# Altium project HYDRA_V3_POWER.PrjPcb (part 1 of 2)
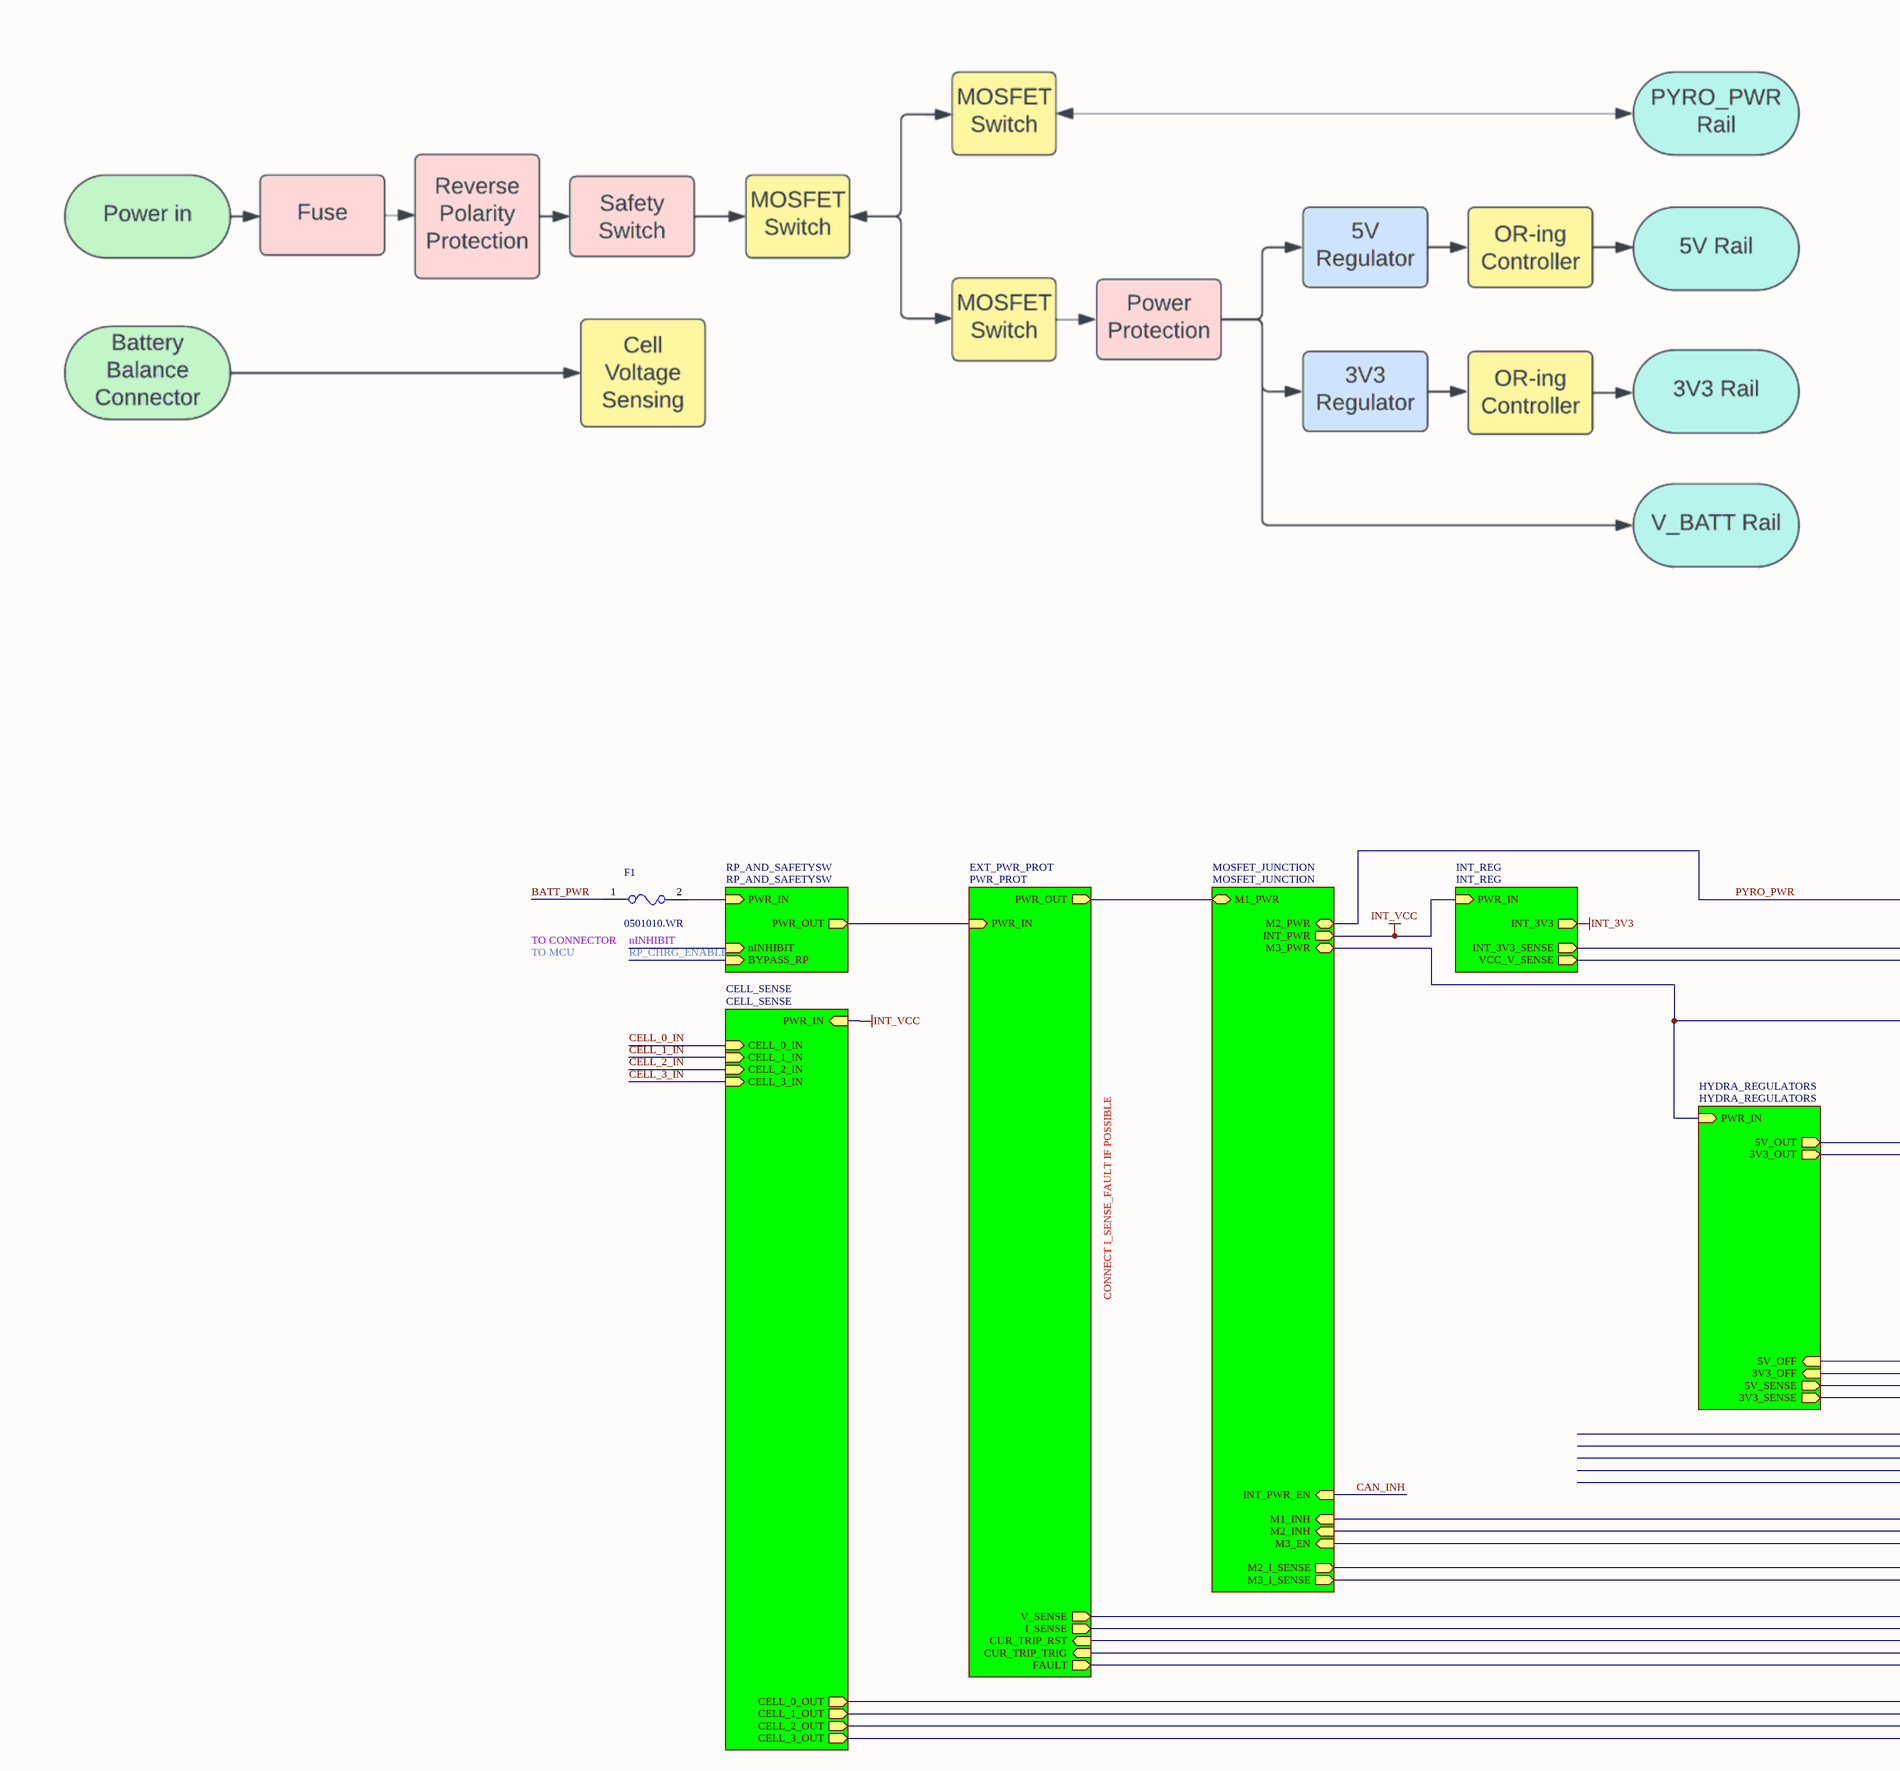
[diagram p0: HYDRA_V3_POWER.SchDoc, top left]
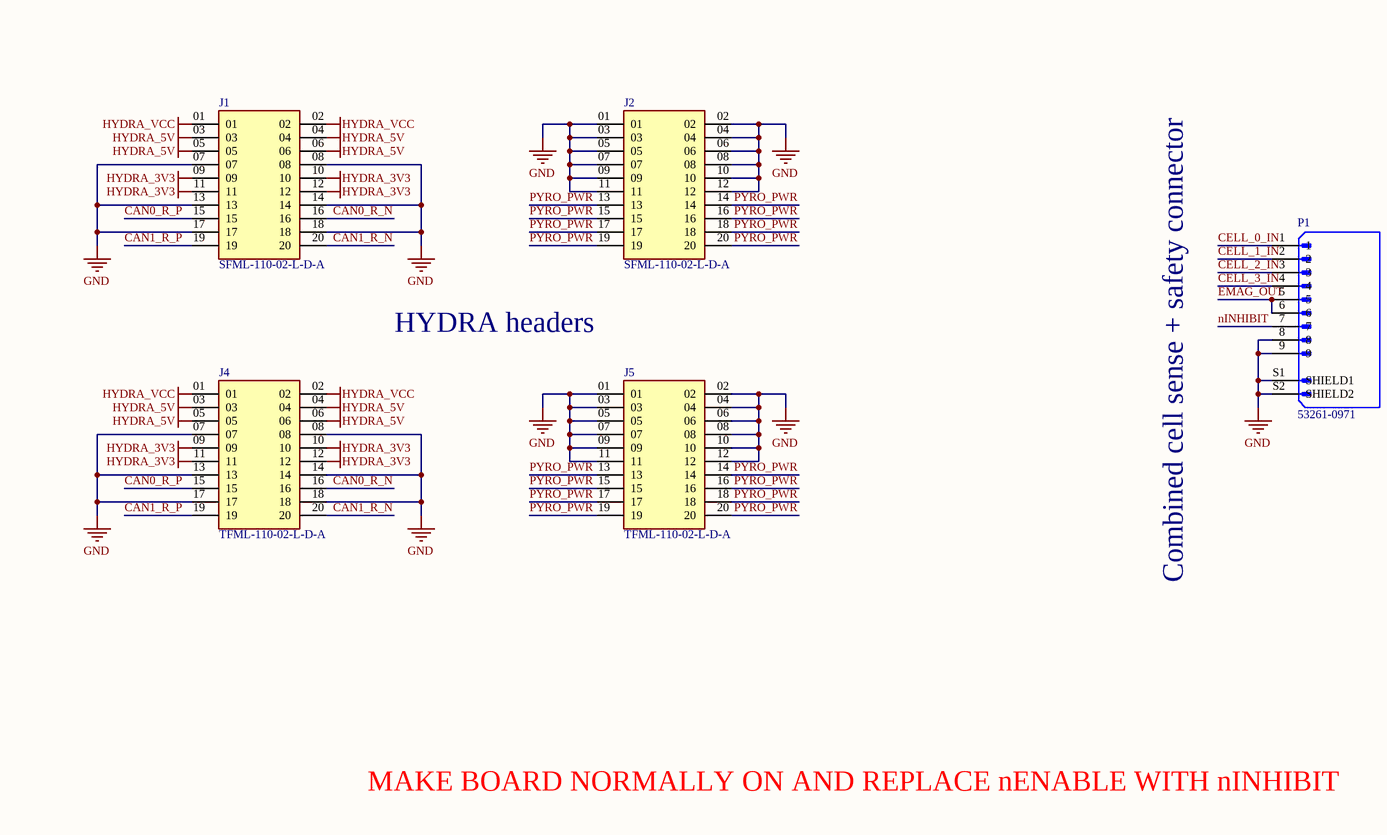
[diagram p1: HYDRA_V3_POWER.SchDoc, bottom left]
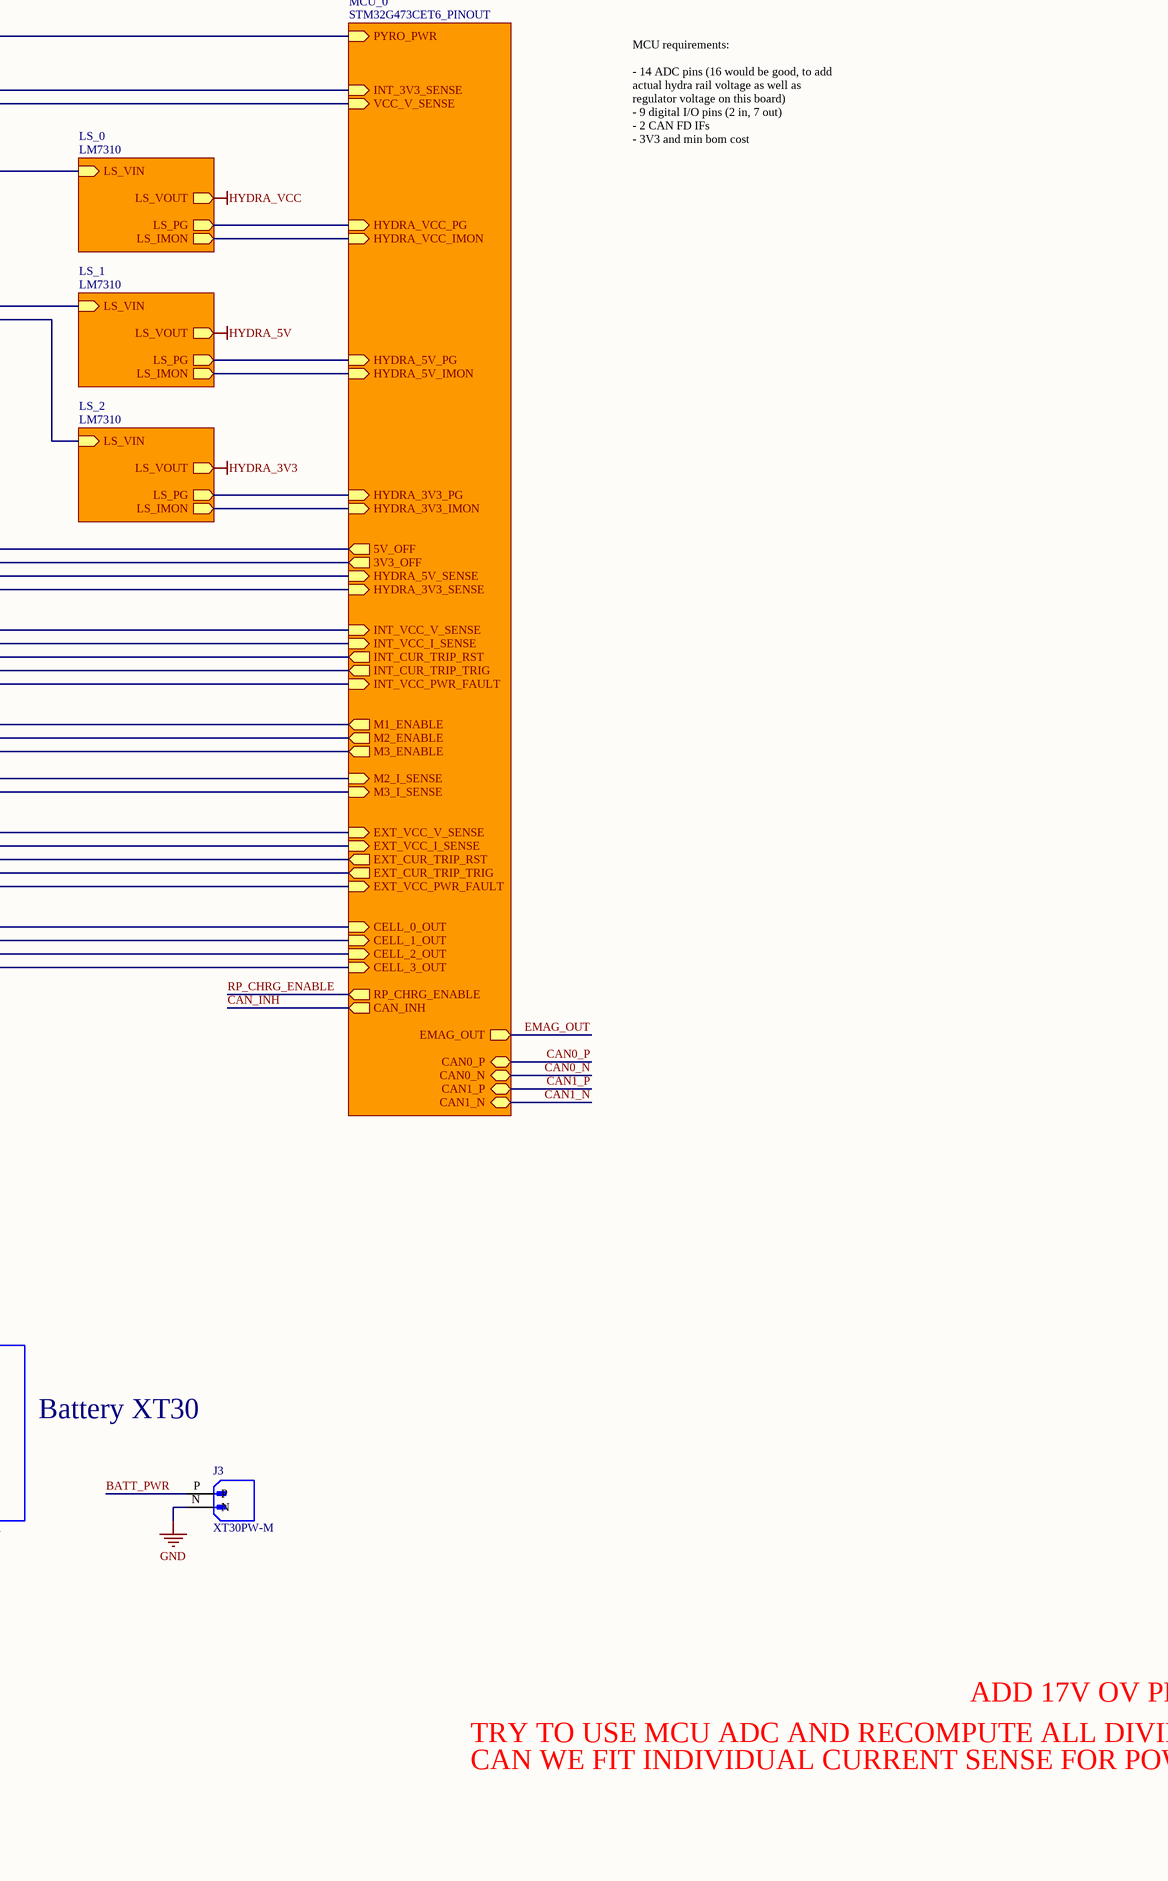
[diagram p2: HYDRA_V3_POWER.SchDoc, bottom right]
9 sheets, 212 parts. Net scope: hierarchical (ports join the sheet entries above them; power ports are global).
Board file: HYDRA_V3_POWER.PcbDoc
Sheets:
  HYDRA_V3_POWER.SchDoc
    MCU_0 = STM32G473CET6_PINOUT.SchDoc
    EXT_PWR_PROT = PWR_PROT.SchDoc
    CELL_SENSE = CELL_SENSE.SchDoc
    MOSFET_JUNCTION = MOSFET_JUNCTION.SchDoc
    INT_REG = INT_REG.SchDoc
    HYDRA_REGULATORS = HYDRA_REGULATORS.SchDoc
    RP_AND_SAFETYSW = RP_AND_SAFETYSW.SchDoc
    LS_0 = LM7310.SchDoc
    LS_1 = LM7310.SchDoc
    LS_2 = LM7310.SchDoc

## Sheet HYDRA_V3_POWER.SchDoc
size C; SheetNumber: 1; SheetTotal: 9

### Parts
F1  0501010.WR  [FP-0501-MFG]
J1  SFML-110-02-L-D-A  [SFML-110-02-L-D-A-Footprint-1]
J2  SFML-110-02-L-D-A  [SFML-110-02-L-D-A-Footprint-1]
J3  XT30PW-M  [XT30PW-M-Footprint-1]
J4  TFML-110-02-L-D-A  [TFML-110-02-L-D-A-Footprint-1]
J5  TFML-110-02-L-D-A  [TFML-110-02-L-D-A-Footprint-1]
P1  53261-0971  [53261-0971-Footprint-1]

### Sub-sheets
CELL_SENSE = CELL_SENSE: CELL_0_IN (in), CELL_1_IN (in), CELL_2_IN (in), CELL_3_IN (in), PWR_IN (in), CELL_0_OUT (out), CELL_1_OUT (out), CELL_2_OUT (out), CELL_3_OUT (out)
EXT_PWR_PROT = PWR_PROT: PWR_IN (in), PWR_OUT (out), V_SENSE (out), I_SENSE (out), CUR_TRIP_RST (in), CUR_TRIP_TRIG (in), FAULT (out)
HYDRA_REGULATORS = HYDRA_REGULATORS: PWR_IN (in), 5V_OUT (out), 3V3_OUT (out), 5V_SENSE (out), 3V3_SENSE (out), 5V_OFF (in), 3V3_OFF (in)
INT_REG = INT_REG: PWR_IN (in), INT_3V3 (out), INT_3V3_SENSE (out), VCC_V_SENSE (out)
LS_0 = LM7310: LS_VIN (in), LS_VOUT (out), LS_PG (out), LS_IMON (out)
LS_1 = LM7310: LS_VIN (in), LS_VOUT (out), LS_PG (out), LS_IMON (out)
LS_2 = LM7310: LS_VIN (in), LS_VOUT (out), LS_PG (out), LS_IMON (out)
MCU_0 = STM32G473CET6_PINOUT: PYRO_PWR (in), INT_3V3_SENSE (in), HYDRA_5V_SENSE (in), HYDRA_3V3_SENSE (in), INT_VCC_V_SENSE (in), INT_VCC_I_SENSE (in), INT_CUR_TRIP_RST (out), INT_CUR_TRIP_TRIG (out), INT_VCC_PWR_FAULT (in), M1_ENABLE (out), M2_ENABLE (out), M3_ENABLE (out), M2_I_SENSE (in), M3_I_SENSE (in), EXT_VCC_V_SENSE (in), EXT_VCC_I_SENSE (in), EXT_CUR_TRIP_RST (out), EXT_CUR_TRIP_TRIG (out), EXT_VCC_PWR_FAULT (in), CELL_0_OUT (in), CELL_1_OUT (in), CELL_2_OUT (in), CELL_3_OUT (in), RP_CHRG_ENABLE (out), VCC_V_SENSE (in), 5V_OFF (out), 3V3_OFF (out), CAN0_P (bidir), CAN0_N (bidir), CAN1_P (bidir), CAN1_N (bidir), HYDRA_5V_PG (in), HYDRA_5V_IMON (in), HYDRA_3V3_PG (in), HYDRA_3V3_IMON (in), HYDRA_VCC_PG (in), HYDRA_VCC_IMON (in), EMAG_OUT (out), CAN_INH (out)
MOSFET_JUNCTION = MOSFET_JUNCTION: M1_PWR (bidir), M2_PWR (bidir), M3_PWR (bidir), INT_PWR (out), M2_I_SENSE (out), M3_I_SENSE (out), M2_INH (in), M1_INH (in), M3_EN (in), INT_PWR_EN (in)
RP_AND_SAFETYSW = RP_AND_SAFETYSW: PWR_IN (in), PWR_OUT (out), nINHIBIT (in), BYPASS_RP (in)

### Nets
GND: J1.07 J1.08 J1.13 J1.14 J1.17 J1.18 J2.01 J2.02 J2.03 J2.04 J2.05 J2.06 J2.07 J2.08 J2.09 J2.10 J2.11 J2.12 J3.N J4.07 J4.08 J4.13 J4.14 J4.17 J4.18 J5.01 J5.02 J5.03 J5.04 J5.05 J5.06 J5.07 J5.08 J5.09 J5.10 J5.11 J5.12 P1.8 P1.9 P1.S1(SHIELD1) P1.S2(SHIELD2)
HYDRA_3V3: J1.09 J1.10 J1.11 J1.12 J4.09 J4.10 J4.11 J4.12 ; sheet LS_2/LS_VOUT
HYDRA_5V: J1.03 J1.04 J1.05 J1.06 J4.03 J4.04 J4.05 J4.06 ; sheet LS_1/LS_VOUT
HYDRA_VCC: J1.01 J1.02 J4.01 J4.02 ; sheet LS_0/LS_VOUT
INT_VCC: sheet CELL_SENSE/PWR_IN, sheet MOSFET_JUNCTION/INT_PWR, sheet INT_REG/PWR_IN  [project net INT_PWR]
3V3_OFF: sheet MCU_0/3V3_OFF, sheet HYDRA_REGULATORS/3V3_OFF
5V_OFF: sheet MCU_0/5V_OFF, sheet HYDRA_REGULATORS/5V_OFF
BATT_PWR: F1.1 J3.P
CAN0_R_N: J1.16 J4.16
CAN0_R_P: J1.15 J4.15
CAN1_R_N: J1.20 J4.20
CAN1_R_P: J1.19 J4.19
CAN_INH: sheet MCU_0/CAN_INH, sheet MOSFET_JUNCTION/INT_PWR_EN
CELL_0_IN: P1.1 ; sheet CELL_SENSE/CELL_0_IN
CELL_0_OUT: sheet MCU_0/CELL_0_OUT, sheet CELL_SENSE/CELL_0_OUT
CELL_1_IN: P1.2 ; sheet CELL_SENSE/CELL_1_IN
CELL_1_OUT: sheet MCU_0/CELL_1_OUT, sheet CELL_SENSE/CELL_1_OUT
CELL_2_IN: P1.3 ; sheet CELL_SENSE/CELL_2_IN
CELL_2_OUT: sheet MCU_0/CELL_2_OUT, sheet CELL_SENSE/CELL_2_OUT
CELL_3_IN: P1.4 ; sheet CELL_SENSE/CELL_3_IN
CELL_3_OUT: sheet MCU_0/CELL_3_OUT, sheet CELL_SENSE/CELL_3_OUT
CUR_TRIP_RST: sheet MCU_0/EXT_CUR_TRIP_RST, sheet EXT_PWR_PROT/CUR_TRIP_RST
EMAG_OUT: P1.5 P1.6 ; sheet MCU_0/EMAG_OUT
EXT_CUR_TRIP_TRIG: sheet MCU_0/EXT_CUR_TRIP_TRIG, sheet EXT_PWR_PROT/CUR_TRIP_TRIG
EXT_VCC_I_SENSE: sheet MCU_0/EXT_VCC_I_SENSE, sheet EXT_PWR_PROT/I_SENSE
EXT_VCC_PWR_FAULT: sheet MCU_0/EXT_VCC_PWR_FAULT, sheet EXT_PWR_PROT/FAULT
EXT_VCC_V_SENSE: sheet MCU_0/EXT_VCC_V_SENSE, sheet EXT_PWR_PROT/V_SENSE
HYDRA_3V3_IMON: sheet MCU_0/HYDRA_3V3_IMON, sheet LS_2/LS_IMON
HYDRA_3V3_PG: sheet MCU_0/HYDRA_3V3_PG, sheet LS_2/LS_PG
HYDRA_3V3_SENSE: sheet MCU_0/HYDRA_3V3_SENSE, sheet HYDRA_REGULATORS/3V3_SENSE
HYDRA_5V_IMON: sheet MCU_0/HYDRA_5V_IMON, sheet LS_1/LS_IMON
HYDRA_5V_PG: sheet MCU_0/HYDRA_5V_PG, sheet LS_1/LS_PG
HYDRA_5V_SENSE: sheet MCU_0/HYDRA_5V_SENSE, sheet HYDRA_REGULATORS/5V_SENSE
HYDRA_VCC_IMON: sheet MCU_0/HYDRA_VCC_IMON, sheet LS_0/LS_IMON
HYDRA_VCC_PG: sheet MCU_0/HYDRA_VCC_PG, sheet LS_0/LS_PG
INT_3V3_SENSE: sheet MCU_0/INT_3V3_SENSE, sheet INT_REG/INT_3V3_SENSE
M1_ENABLE: sheet MCU_0/M1_ENABLE, sheet MOSFET_JUNCTION/M1_INH
M1_PWR: sheet EXT_PWR_PROT/PWR_OUT, sheet MOSFET_JUNCTION/M1_PWR
M2_ENABLE: sheet MCU_0/M2_ENABLE, sheet MOSFET_JUNCTION/M2_INH
M2_I_SENSE: sheet MCU_0/M2_I_SENSE, sheet MOSFET_JUNCTION/M2_I_SENSE
M3_ENABLE: sheet MCU_0/M3_ENABLE, sheet MOSFET_JUNCTION/M3_EN
M3_I_SENSE: sheet MCU_0/M3_I_SENSE, sheet MOSFET_JUNCTION/M3_I_SENSE
M3_PWR: sheet MOSFET_JUNCTION/M3_PWR, sheet HYDRA_REGULATORS/PWR_IN, sheet LS_0/LS_VIN
nINHIBIT: P1.7 ; sheet RP_AND_SAFETYSW/nINHIBIT
PWR_IN: sheet EXT_PWR_PROT/PWR_IN, sheet RP_AND_SAFETYSW/PWR_OUT
PYRO_PWR: J2.13 J2.14 J2.15 J2.16 J2.17 J2.18 J2.19 J2.20 J5.13 J5.14 J5.15 J5.16 J5.17 J5.18 J5.19 J5.20 ; sheet MCU_0/PYRO_PWR, sheet MOSFET_JUNCTION/M2_PWR  [project net M2_PWR]
RP_CHRG_ENABLE: sheet MCU_0/RP_CHRG_ENABLE, sheet RP_AND_SAFETYSW/BYPASS_RP
VCC_V_SENSE: sheet MCU_0/VCC_V_SENSE, sheet INT_REG/VCC_V_SENSE
NetC14_1: sheet HYDRA_REGULATORS/5V_OUT, sheet LS_1/LS_VIN
NetC19#2_1: sheet HYDRA_REGULATORS/3V3_OUT, sheet LS_2/LS_VIN
NetD1_1: F1.2 ; sheet RP_AND_SAFETYSW/PWR_IN

### Notes on the sheet
- TO MCU
- (near F1) TO CONNECTOR
- MCU requirements:
  - 14 ADC pins (16 would be good, to add actual hydra rail voltage as well as regulator voltage on this board)
  - 9 digital I/O pins (2 in, 7 out)
  - 2 CAN FD IFs
  - 3V3 and min bom cost
- CONNECT I_SENSE_FAULT IF POSSIBLE
- HYDRA headers
- Battery XT30
- Combined cell sense + safety connector
- ADD 17V OV PROT
- TRY TO USE MCU ADC AND RECOMPUTE ALL DIVIDERS/UP RESISTANCE
- CAN WE FIT INDIVIDUAL CURRENT SENSE FOR POWER BOARD CONTRIBUTION TO HYDRA 5V AND 3V3
- MAKE BOARD NORMALLY ON AND REPLACE nENABLE WITH nINHIBIT

### Library data of the parts
F1 = CMP-08605-000084-1: FUSE BOARD MOUNT 10A 32VDC 1206; Working Voltage: 32V; Approvals: UL; Fuse Type: Board Mount (Cartridge Style Excluded); DC Cold Resistance: 4.27mR; Depth: 1.63mm; Housing Material: Ceramic; Max Operating Temperature: 150°C; Voltage Rating (DC): 32V; Width: 1.63mm; Height: 0.033inch; Current Rating: 10A; Composition: Ceramic; Lead Free: Lead Free; Case Code (Metric): 3216; Min Operating Temperature: -55°C; Packaging: Tape and Reel; Mount: Surface Mount; Case/Package: 1206; Case Code (Imperial): 1206; Package Quantity: 3000; Length: 3.2mm
J1 J2 = CMP-002-00043-1: Board Connector, 20 Contact(s), 2 Row(s), Female, Straight, 0.05 inch Pitch, Surface Mount Terminal, Locking, Black Insulator, Socket; RoHS Compliant: Yes; Connector Type: BOARD CONNECTOR; Mounting Technology: Board
J3 = CMP-002-00064-1
J4 J5 = CMP-002-00042-1: Board Connector, 20 Contact(s), 2 Row(s), Male, Straight, Surface Mount Terminal; Connector Type: BOARD CONNECTOR; Mounting Technology: Board; RoHS Compliant: Yes
P1 = CMP-002-00065-2: Board Connector, 9 Contact(s), 1 Row(s), Male, Right Angle, 0.049 inch Pitch, Surface Mount Terminal, Locking, Natural Insulator, Receptacle; Connector Type: BOARD CONNECTOR; Max Operating Temperature: 85°C; Mounting Technology: Board; Min Operating Temperature: -40°C; RoHS Compliant: Yes

## Sheet STM32G473CET6_PINOUT.SchDoc
size C; SheetNumber: 8; SheetTotal: 9
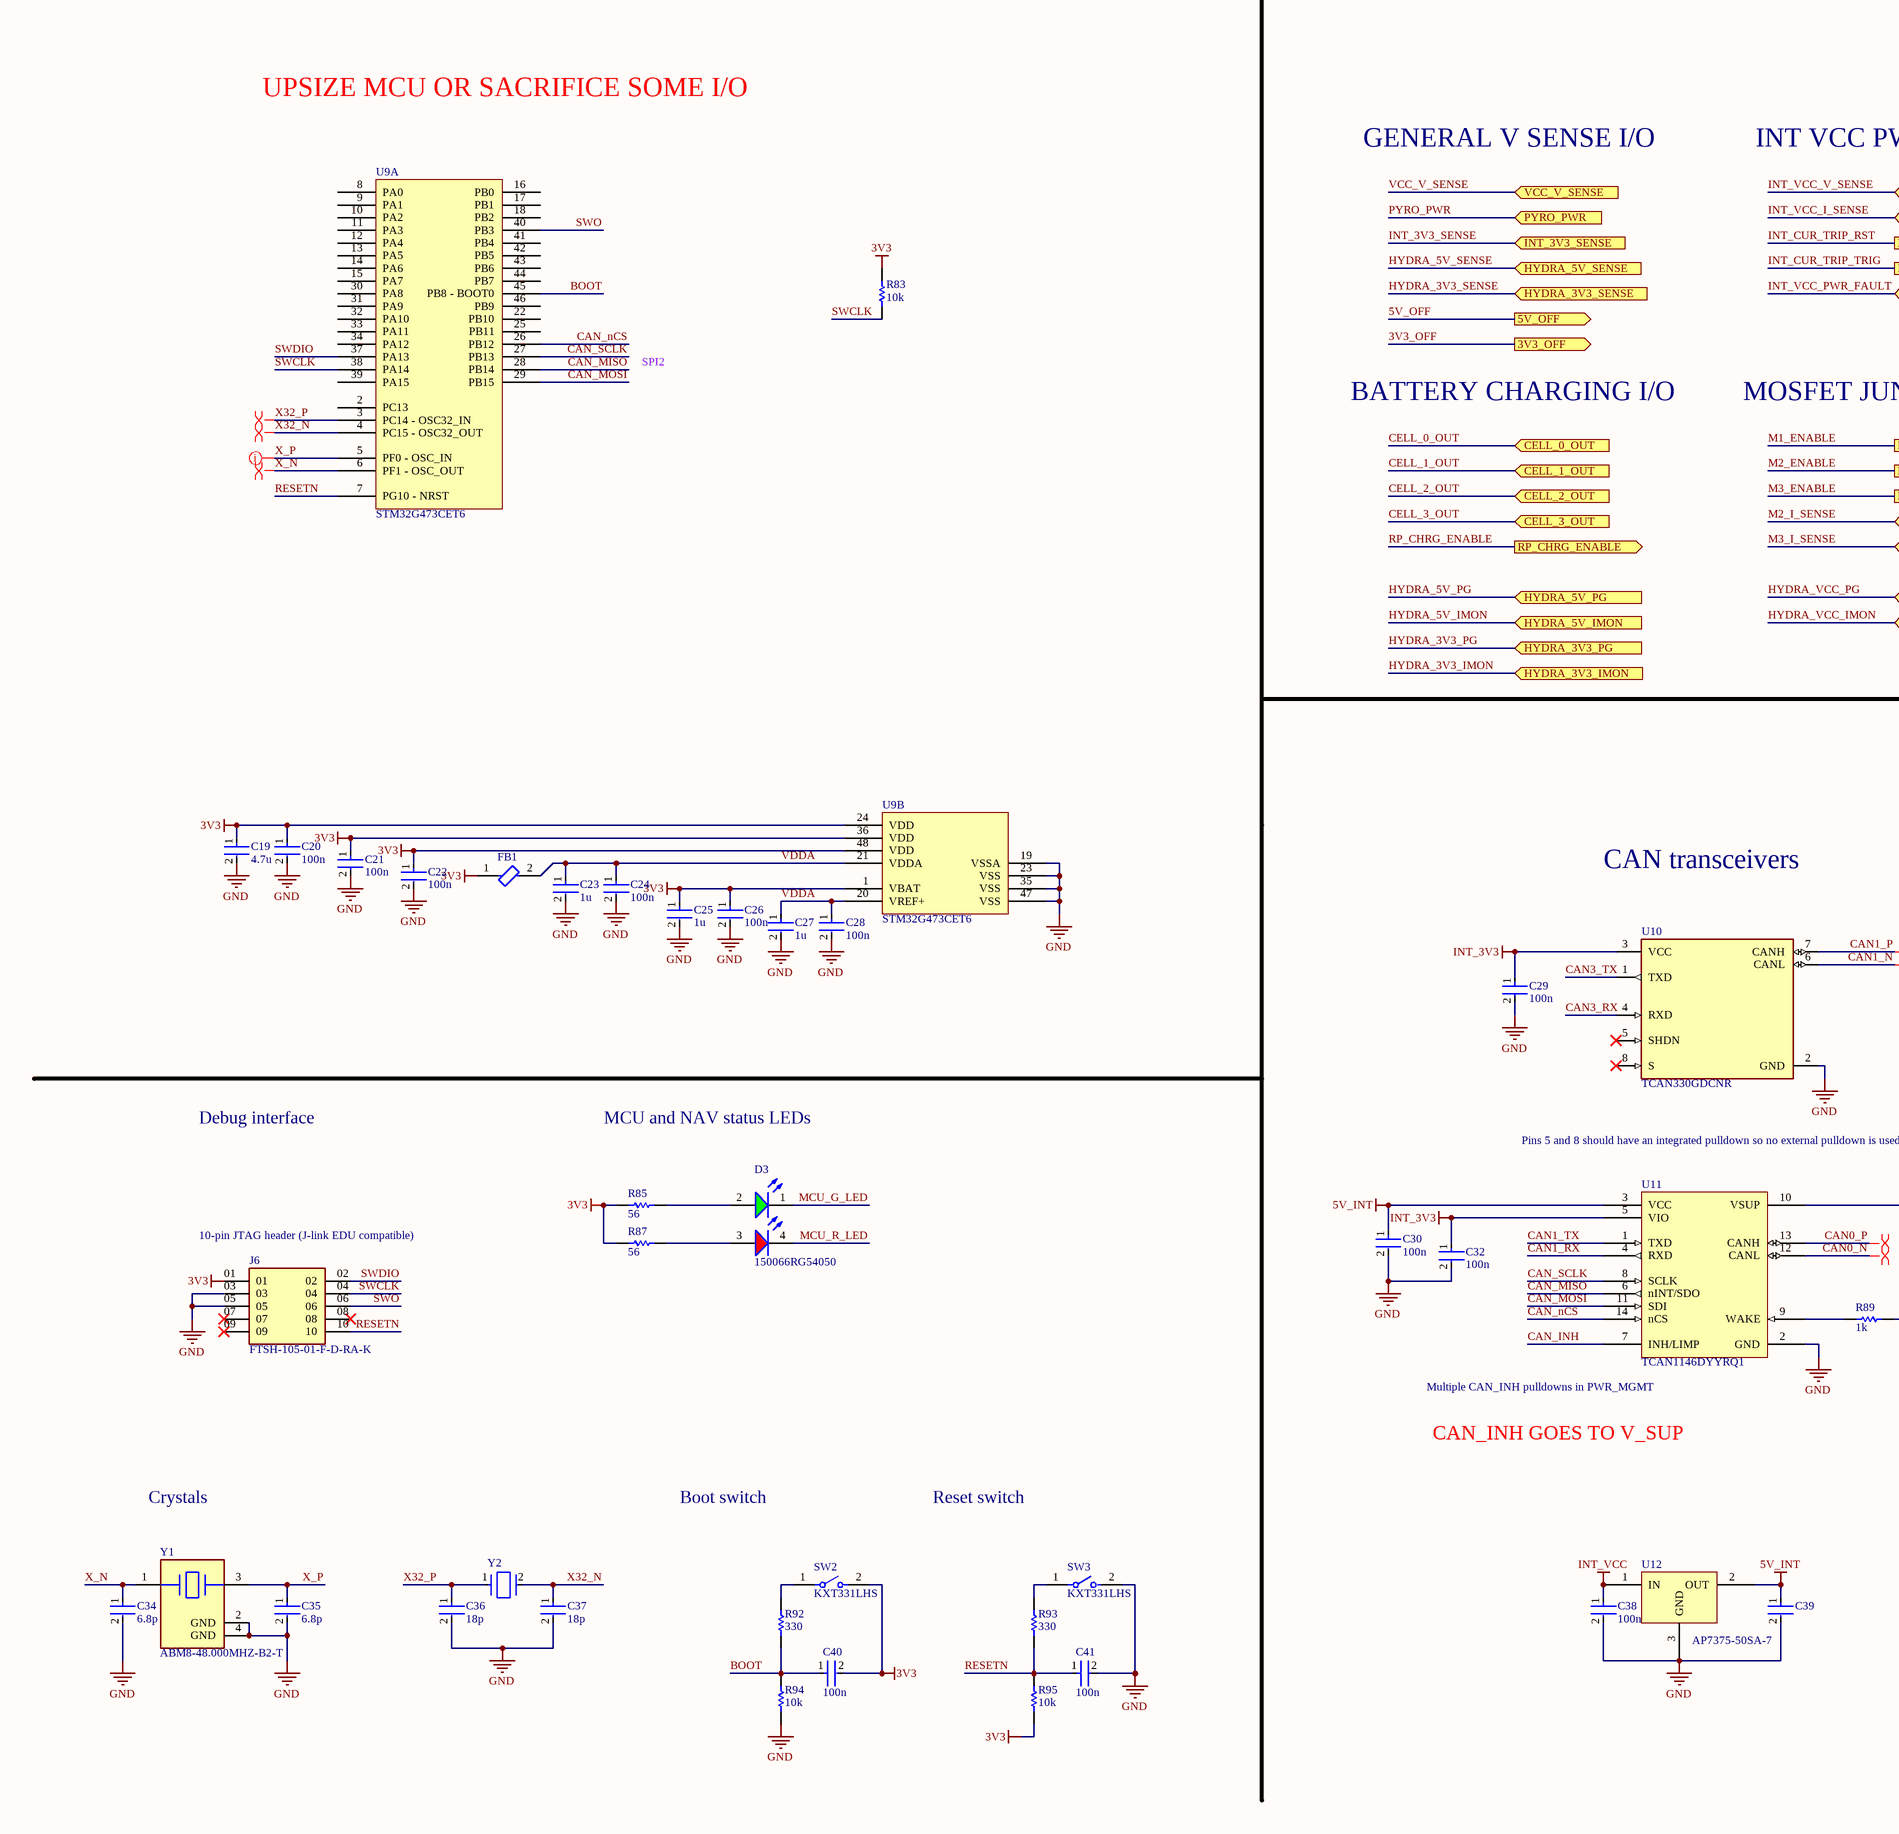
[diagram p3: STM32G473CET6_PINOUT.SchDoc, left]
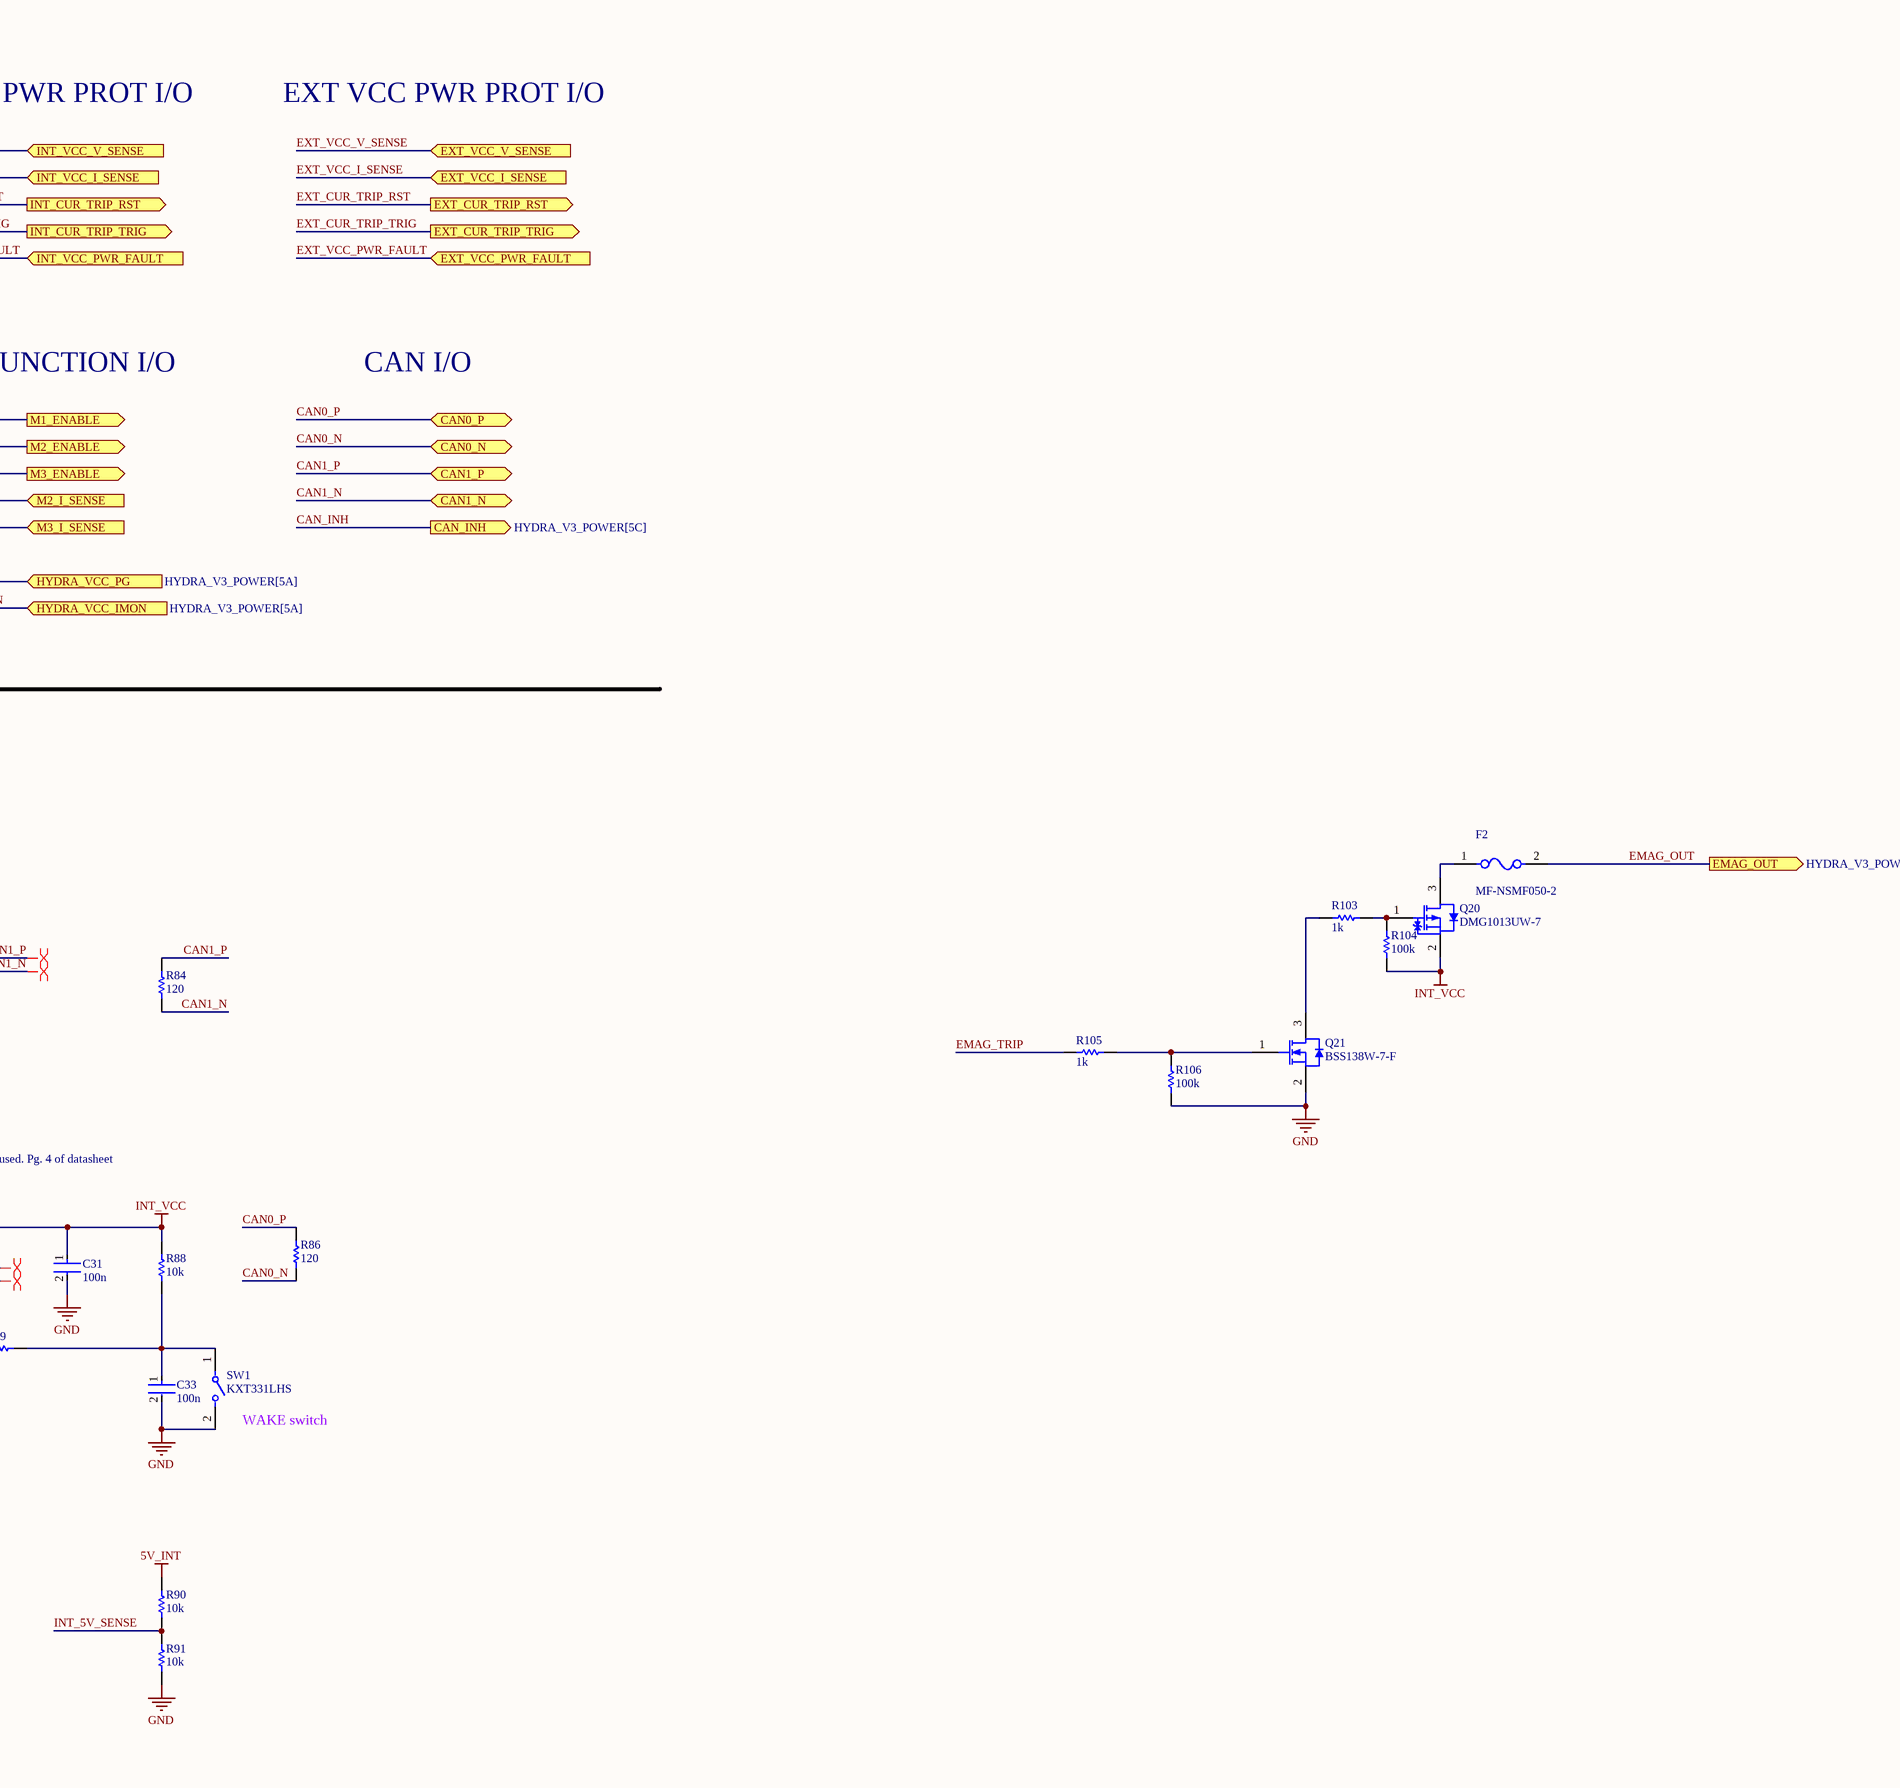
[diagram p4: STM32G473CET6_PINOUT.SchDoc, right]

### Parts
(Parts that share a designator on the sheet are numbered #1, #2 ... from top to bottom, then left to right.)
C19#1  4.7u  [FP-0402-L_1_0_0_05-W_0_5-IPC_A]
C20#1  100n  [FP-0402-L_1_0_0_05-W_0_5-IPC_A]
C21#1  100n  [FP-0402-L_1_0_0_05-W_0_5-IPC_A]
C22#1  100n  [FP-0402-L_1_0_0_05-W_0_5-IPC_A]
C23  1u  [FP-0402-L_1_0_0_05-W_0_5-IPC_A]
C24  100n  [FP-0402-L_1_0_0_05-W_0_5-IPC_A]
C25  1u  [FP-0402-L_1_0_0_05-W_0_5-IPC_A]
C26  100n  [FP-0402-L_1_0_0_05-W_0_5-IPC_A]
C27  1u  [FP-0402-L_1_0_0_05-W_0_5-IPC_A]
C28  100n  [FP-0402-L_1_0_0_05-W_0_5-IPC_A]
C29  100n  [FP-0402-L_1_0_0_05-W_0_5-IPC_A]
C30  100n  [FP-0402-L_1_0_0_05-W_0_5-IPC_A]
C31  100n  [FP-0402-L_1_0_0_05-W_0_5-IPC_A]
C32  100n  [FP-0402-L_1_0_0_05-W_0_5-IPC_A]
C33  100n  [FP-0402-L_1_0_0_05-W_0_5-IPC_A]
C34  6.8p  [FP-0402-L_1_0_0_05-W_0_5-IPC_A]
C35  6.8p  [FP-0402-L_1_0_0_05-W_0_5-IPC_A]
C36  18p  [FP-0402-L_1_0_0_05-W_0_5-IPC_A]
C37  18p  [FP-0402-L_1_0_0_05-W_0_5-IPC_A]
C38  100n  [FP-0402-L_1_0_0_05-W_0_5-IPC_A]
C39  CL05A106MP5NUNC  [FP-CL05A106MP5NUNC-MFG]  (value not drawn)
C40  100n  [FP-0402-L_1_0_0_05-W_0_5-IPC_A]
C41  100n  [FP-0402-L_1_0_0_05-W_0_5-IPC_A]
D3  150066RG54050  [WL-SBCD_0606]
F2  MF-NSMF050-2  [FP-MF-NSMF050-2-MFG]
FB1  BLM15PX601SN1D  [FP-BLM15-0_05-MFG]  (value not drawn)
J6  FTSH-105-01-F-D-RA-K  [FTSH-105-01-F-D-RA-K-Footprint-1]
Q20  DMG1013UW-7  [DIOD-SOT323-3_V]
Q21  BSS138W-7-F  [DIOD-SOT323-3_V]
R83  10k  [R0603B]
R84  120  [R0603B]
R85  56  [R0603B]
R86  120  [R0603B]
R87  56  [R0603B]
R88  10k  [R0603B]
R89  1k  [R0603B]
R90  10k  [R0603B]
R91  10k  [R0603B]
R92  330  [R0603B]
R93  330  [R0603B]
R94  10k  [R0603B]
R95  10k  [R0603B]
R103  1k  [R0603B]
R104  100k  [R0603B]
R105  1k  [R0603B]
R106  100k  [R0603B]
SW1  KXT331LHS  [FP-KXT331LHS-MFG]
SW2  KXT331LHS  [FP-KXT331LHS-MFG]
SW3  KXT331LHS  [FP-KXT331LHS-MFG]
U9  STM32G473CET6  [TSQFP50P900X900X160-48N]  (parts A,B of 2)
U10  TCAN330GDCNR  [FP-DCN0008A-MFG]
U11  TCAN1146DYYRQ1  [TCAN1146DYYRQ1-Footprint-1]
U12  AP7375-50SA-7  [AP7375-50SA-7-Footprint-1]
Y1  ABM8-48.000MHZ-B2-T  [FP-ABM8-MFG]
Y2  ECS-.327-12.5-1210-TR  [FP-ECX-1210-MFG]  (value not drawn)

### Ports
3V3_OFF (out, see HYDRA_V3_POWER[5B], HYDRA_REGULATORS[1A]), 5V_OFF (out, see HYDRA_V3_POWER[5B], HYDRA_REGULATORS[1A]), CAN0_N (bidir, see HYDRA_V3_POWER[5C]), CAN0_P (bidir, see HYDRA_V3_POWER[5C]), CAN1_N (bidir, see HYDRA_V3_POWER[5C]), CAN1_P (bidir, see HYDRA_V3_POWER[5C]), CAN_INH (out, see HYDRA_V3_POWER[5C]), CELL_0_OUT (in, see HYDRA_V3_POWER[5C], CELL_SENSE[4A]), CELL_1_OUT (in, see HYDRA_V3_POWER[5C], CELL_SENSE[4A]), CELL_2_OUT (in, see HYDRA_V3_POWER[5C], CELL_SENSE[4A]), CELL_3_OUT (in, see HYDRA_V3_POWER[5C], CELL_SENSE[4A]), EMAG_OUT (out, see HYDRA_V3_POWER[5C]), EXT_CUR_TRIP_RST (out, see HYDRA_V3_POWER[5C]), EXT_CUR_TRIP_TRIG (out, see HYDRA_V3_POWER[5C]), EXT_VCC_I_SENSE (in, see HYDRA_V3_POWER[5C]), EXT_VCC_PWR_FAULT (in, see HYDRA_V3_POWER[5C]), EXT_VCC_V_SENSE (in, see HYDRA_V3_POWER[5C]), HYDRA_3V3_IMON (in, see HYDRA_V3_POWER[5B]), HYDRA_3V3_PG (in, see HYDRA_V3_POWER[5B]), HYDRA_3V3_SENSE (in, see HYDRA_V3_POWER[5B]), HYDRA_5V_IMON (in, see HYDRA_V3_POWER[5B]), HYDRA_5V_PG (in, see HYDRA_V3_POWER[5B]), HYDRA_5V_SENSE (in, see HYDRA_V3_POWER[5B]), HYDRA_VCC_IMON (in, see HYDRA_V3_POWER[5A]), HYDRA_VCC_PG (in, see HYDRA_V3_POWER[5A]), INT_3V3_SENSE (in, see HYDRA_V3_POWER[5A], INT_REG[3B]), INT_CUR_TRIP_RST (out, see HYDRA_V3_POWER[5B]), INT_CUR_TRIP_TRIG (out, see HYDRA_V3_POWER[5B]), INT_VCC_I_SENSE (in, see HYDRA_V3_POWER[5B]), INT_VCC_PWR_FAULT (in, see HYDRA_V3_POWER[5B]), INT_VCC_V_SENSE (in, see HYDRA_V3_POWER[5B]), M1_ENABLE (out, see HYDRA_V3_POWER[5B]), M2_ENABLE (out, see HYDRA_V3_POWER[5B]), M2_I_SENSE (in, see HYDRA_V3_POWER[5C], MOSFET_JUNCTION[5A]), M3_ENABLE (out, see HYDRA_V3_POWER[5B]), M3_I_SENSE (in, see HYDRA_V3_POWER[5C], MOSFET_JUNCTION[5C]), PYRO_PWR (in, see HYDRA_V3_POWER[5A]), RP_CHRG_ENABLE (out, see HYDRA_V3_POWER[5C]), VCC_V_SENSE (in, see HYDRA_V3_POWER[5A], INT_REG[3C])

### Nets
3V3: C19#1.1 C20#1.1 C21#1.1 C22#1.1 C25.1 C26.1 C40.2 FB1.1 J6.01 R83.2 R85.2 R87.2 R95.1 SW2.2 U9.1(VBAT) U9.24(VDD) U9.36(VDD) U9.48(VDD)
5V_INT: C30.1 C39.1 R90.2 U11.3(VCC) U12.2(OUT)
GND: C19#1.2 C20#1.2 C21#1.2 C22#1.2 C23.2 C24.2 C25.2 C26.2 C27.2 C28.2 C29.2 C30.2 C31.2 C32.2 C33.2 C34.2 C35.2 C36.2 C37.2 C38.2 C39.2 C41.2 J6.03 J6.05 Q21.2(S) R91.1 R94.1 R106.1 SW1.2 SW3.2 U9.19(VSSA) U9.23(VSS) U9.35(VSS) U9.47(VSS) U10.2(GND) U11.2(GND) U12.3(GND) Y1.2(GND) Y1.4(GND)
INT_3V3: C29.1 C32.1 U10.3(VCC) U11.5(VIO)
INT_VCC: C31.1 C38.1 Q20.2(S) R88.2 R104.2 U11.10(VSUP) U12.1(IN)  [project net INT_PWR]
BOOT: C40.1 R92.1 R94.2 U9.45(PB8_-_BOOT0)
CAN0_N: R86.1 U11.12(CANL) ; port CAN0_N
CAN0_P: R86.2 U11.13(CANH) ; port CAN0_P
CAN1_N: R84.1 U10.6(CANL) ; port CAN1_N
CAN1_P: R84.2 U10.7(CANH) ; port CAN1_P
CAN1_RX: U11.4(RXD)
CAN1_TX: U11.1(TXD)
CAN3_RX: U10.4(RXD)
CAN3_TX: U10.1(TXD)
CAN_INH: U11.7(INH/LIMP) ; port CAN_INH
CAN_MISO: U9.28(PB14) U11.6(nINT/SDO)
CAN_MOSI: U9.29(PB15) U11.11(SDI)
CAN_nCS: U9.26(PB12) U11.14(nCS)
CAN_SCLK: U9.27(PB13) U11.8(SCLK)
EMAG_OUT: F2.2 ; port EMAG_OUT
EMAG_TRIP: R105.2
EXT_CUR_TRIP_TRIG: port EXT_CUR_TRIP_TRIG
INT_5V_SENSE: R90.1 R91.2
INT_CUR_TRIP_RST: port INT_CUR_TRIP_RST
INT_CUR_TRIP_TRIG: port INT_CUR_TRIP_TRIG
INT_VCC_I_SENSE: port INT_VCC_I_SENSE
INT_VCC_PWR_FAULT: port INT_VCC_PWR_FAULT
INT_VCC_V_SENSE: port INT_VCC_V_SENSE
MCU_G_LED: D3.1(K)
MCU_R_LED: D3.4(K)
RESETN: C41.1 J6.10 R93.1 R95.2 U9.7(PG10_-_NRST)
SWCLK: J6.04 R83.1 U9.38(PA14)
SWDIO: J6.02 U9.37(PA13)
SWO: J6.06 U9.40(PB3)
VDDA: C23.1 C24.1 C27.1 C28.1 FB1.2 U9.20(VREF+) U9.21(VDDA)
X32_N: C37.1 U9.4(PC15_-_OSC32_OUT) Y2.2(Out/In)
X32_P: C36.1 U9.3(PC14_-_OSC32_IN) Y2.1(In/Out)
X_N: C34.1 U9.6(PF1_-_OSC_OUT) Y1.1
X_P: C35.1 U9.5(PF0_-_OSC_IN) Y1.3
NetC33_1: C33.1 R88.1 R89.1 SW1.1
NetD3_2: D3.2(A) R85.1
NetD3_3: D3.3(A) R87.1
NetF2_1: F2.1 Q20.3(D)
NetQ20_1: Q20.1(G) R103.1 R104.1
NetQ21_1: Q21.1(G) R105.1 R106.2
NetQ21_3: Q21.3(D) R103.2
NetR89_2: R89.2 U11.9(WAKE)
NetR92_2: R92.2 SW2.1
NetR93_2: R93.2 SW3.1

Not connected (* = marked no-connect by the designer): J6 07* 08* 09*; U9 2(PC13) 8(PA0) 9(PA1) 10(PA2) 11(PA3) 12(PA4) 13(PA5) 14(PA6) 15(PA7) 16(PB0) 17(PB1) 18(PB2) 22(PB10) 25(PB11) 30(PA8) 31(PA9) 32(PA10) 33(PA11) 34(PA12) 39(PA15) 41(PB4) 42(PB5) 43(PB6) 44(PB7) 46(PB9); U10 5(SHDN)* 8(S)*

### Layout directives
differential pair: CAN1_N, CAN1_P, X32_N, X32_P, X_N, X_P
differential pair; differential pair class 120DIFF: CAN0_N, CAN0_P

### Notes on the sheet
- UPSIZE MCU OR SACRIFICE SOME I/O
- GENERAL V SENSE I/O
- INT VCC PWR PROT I/O
- EXT VCC PWR PROT I/O
- SPI2
- BATTERY CHARGING I/O
- MOSFET JUNCTION I/O
- CAN I/O
- CAN transceivers
- Debug interface
- MCU and NAV status LEDs
- Pins 5 and 8 should have an integrated pulldown so no external pulldown is used. Pg. 4 of datasheet
- (near J6) 10-pin JTAG header (J-link EDU compatible)
- (near U11) Multiple CAN_INH pulldowns in PWR_MGMT
- (near SW1) WAKE switch
- CAN_INH GOES TO V_SUP
- Crystals
- Boot switch
- Reset switch

### Library data of the parts
C19#1 C20#1 C21#1 C22#1 C23-C38 C40 C41 = CMP-001-00058-1: LARGE PADS, 0402 CAP, CHANGE COMMENT TO MATCH REAL P/N; Capacitor Type: Ceramic; Min Operating Temperature: -55°C; Mounting Technology: Surface Mount; Pins: 2; Case/Package: 0402; RoHS Compliant: Yes; Max Operating Temperature: 85°C
C39 = CMP-13271-000002-1: CAP CER 10UF 10V X5R 0402; Manufacturer: Samsung; Temperature Coefficient: 15%; Tolerance: 20%; Material: Ceramic; Octopart: https://octopart.com/cl05a106mp5nunc-samsung-22457395; Voltage Rating: 10V; RoHS: TRUE; Value: 10uF; Height: 0.7mm; Digikey Description: CAP CER 10UF 10V X5R 0402; Automotive: No; Package: CL05A106MP5NUNC; Device Class L1: Passive Components; Capacitance: 10uF; Temperature Range High: +85°C; ComponentLink2Description: Datasheet; Device Class L2: Capacitors; Temperature Characteristic: X5R; Manufacturer Part Number: CL05A106MP5NUNC; Temperature: -55°C to +85°C; ComponentLink2URL: http://www.samsungsem.com/kr/support/product-search/mlcc/__icsFiles/afieldfile/2019/05/10/19-CL05A106MP5NUNC.pdf; Device Class L3: Ceramic Capacitors; Category: Cap; Temperature Range Low: -55°C; Ipc Land Pattern Name: CAPC10050X50; Lead Free: Yes
D3 = CMP-004-00040-2: Led, Red/Grn, 180Mcd/230Mcd, 624Nm/525Nm Rohs Compliant: Yes; Source: rgled.SchLib; Component Type: Standard; Design Item ID: CMP-004-00034-2; Pins: 4
F2 = CMP-07400-000036-1: PTC RESET FUSE 13.2V 500MA 1206; Manufacturer: Bourns; Resistance: 0.15-0.7Ω; Hold Current: 0.5A; Trip Current: 1A; Current Rating: 100A; Value: 0.15-0.7Ω; Automotive Grade: Grade 3; Trip Time: 0.1s; Temperature Range Low: -40°C; Temperature: -40°C to +85°C; Digikey Description: PTC RESET FUSE 13.2V 500MA 1206; Ambient Temperature Range Low: -40°C; RoHS: TRUE; Device Class L2: PTC Resettable Fuses; Octopart: https://octopart.com/mf-nsmf050-2-bourns-34532; ComponentLink2Description: Datasheet; Voltage Rating: 13.2V; Category: Fuse; ComponentLink2URL: https://www.bourns.com/docs/product-datasheets/mfnsmf.pdf?sfvrsn=39c76af6_14; Mouser Description: Resettable Fuses - PPTC 0.50A 13.2V 0.15ohm 1206 Footprint; Temperature Range High: +85°C; Device Class L1: Circuit Protection; Device Class L3: unset; Automotive: Yes; Package: MF-NSMF050-2; Ambient Temperature Range High: +85°C; Height: 0.85mm; Manufacturer Part Number: MF-NSMF050-2; Lead Free: Yes
FB1 = CMP-0686-00252-4: Chip Ferrite Bead, 0402, 600Ω @ 100MHz, 0.23Ω, 25%, 900mA; Number of Circuits: 1; Impedance: 600R; DC Resistance (DCR): 230mR; Material: Steel; Length: 1mm; Package Quantity: 10000; Height: 0.5mm; Width: 0.5mm; Max DC Current: 900mA; Number of Lines: 1; Termination: SMD/SMT; Packaging: Tape and Reel; Lead Free: Lead Free; Min Operating Temperature: -55°C; Max Operating Temperature: 125°C; Max Current Rating: 900mA; Case Code (Imperial): 0402; Number of Pins: 2; Current Rating: 900mA; Test Frequency: 100MHz; Case/Package: 0402; Tolerance: 25%; Case Code (Metric): 1005
J6 = CMP-002-00041-5: Board Connector, 10 Contact(s), 2 Row(s), Male, Right Angle, 0.05 inch Pitch, Surface Mount Terminal, Locking, Black Insulator; Connector Type: BOARD CONNECTOR; Mounting Technology: Board; RoHS Compliant: Yes
Q20 = CMP-2000-06170-1: P-Channel Enhancement Mode MOSFET, 310 mW, 20 V, -55 to 150 degC, 3-Pin SOT-323, RoHS, Tape and Reel; Manufacturer: Diodes Inc; Qg Gate Charge: 0.622nC; Drain-Source On Resistance-Max: 750mO; Rated Power Dissipation: 310mW; Drain-to-Source Voltage [Vdss]: 20V; Package Reference: SOT323; Datasheet Version: Rev. 3-2, 09/2013; Package Description: 3-Pin Small Outline Transistor, Body 2 x 1.25 mm, Pitch 0.65 mm; Mounting Technology: SurfaceMount; Manufacturer URL: http://www.diodes.com/; Datasheet URL: http://www.diodes.com/_files/datasheets/ds31861.pdf; Channel Type: P-Channel
Q21 = CMP-2000-05968-1: N-Channel Enhancement Mode Mosfet, 50 V, 200 mA, -55 to 150 degC, 6-Pin SOT-323, RoHS, Tape and Reel; Typical Turn-Off Delay Time: 20ns; Number of Channels: 1Channel; Type: EnhancementModeFieldEffectTransistor; Brand: DiodesIncorporated; Vds - Drain-Source Breakdown Voltage: 75V; Vgs - Gate-Source Voltage: 20V; Rds On - Drain-Source Resistance: 1.4Ohms; Transistor Type: 1N-Channel; Configuration: Single; Unit Weight: 0.000212oz; Pd - Power Dissipation: 200mW; Id - Continuous Drain Current: 200mA; Forward Transconductance - Min: 0.1S; Manufacturer URL: http://www.diodes.com/; Series: BSS138; Package Description: 3-Pin Small Outline Transistor, Body 2 x 1.25 mm, Pitch 0.65 mm; Mounting Technology: SurfaceMount; Product Category: MOSFET; RoHS: True; Maximum Operating Temperature: +150C; Height: 1mm; Length: 2.2mm; Technology: Si; Width: 1.35mm; Datasheet URL: http://www.diodes.com/_files/datasheets/ds30206.pdf; Manufacturer: DiodesIncorporated; Package / Case: SOT-323-3; Typical Turn-On Delay Time: 20ns; Transistor Polarity: N-Channel; Factory Pack Quantity: 3000; Packaging: Reel; Product: MOSFETSmallSignal; Datasheet Version: Rev. 11-2, 09/2013; Package Reference: SOT323; Minimum Operating Temperature: -55C; Mounting Style: SMD/SMT; Channel Mode: Enhancement
R83-R95 R103-R106 = CMP-009-00002-14: Resistor
SW1-SW3 = CMP-10040-000029-1: SWITCH TACTILE SPST-NO 0.02A 15V; Operating Force: 240gf; Switch Travel: 0.13mm; Illumination Type: Non-Illuminated; Throw Configuration: SPST; Number of Ports: 1; Current Rating: 5A; Mechanical Life: 500000Cycles; Switch Function: Off-Mom; Connector Type: USB; Actuator Type: Standard; Gender: Receptacle; Number of Contacts: 24; Contact Plating: Gold; Insulation Color: Black; Min Operating Temperature: -40°C; Packaging: Tape and Reel; Flammability Rating: UL94 V-0; Max Operating Temperature: 85°C; Termination: Solder; Mount: Surface Mount
U9 = CMP-020-00018-2: RISC Microcontroller, 32-Bit, 170MHz; RoHS Compliant: Yes
U10 = CMP-04872-000178-1: IC TRANSCEIVER 1/1 SOT23-8; Data Rate: 1Mbps; Packaging: Tape and Reel; Min Operating Temperature: -40°C; Max Operating Temperature: 125°C; RoHS Compliant: Yes; Lead Free: Lead Free; Case/Package: SOT-23-8; Mount: Surface Mount
U11 = CMP-318-000000-2: Automotive CAN FD transceiver with watchdog, bus diagnostics and partial networking via sele 14-SOT-23-THIN -40 to 150; Component Type: Standard; Design Item ID: CMP-015-00012-2; Pin Count: 14; Source: TCAN1146DYYRQ1.SchLib
U12 = CMP-019-00041-1: Ldo Cmos Lowcurr SOT23 T&r 3K
Y1 = CMP-27762-011708-1: Crystal 48MHz ±20ppm 18pF SMD-4 3.2mm x 2.5mm; Series Resistance: 35R; Frequency Stability: 50ppm; Package Quantity: 1000; Packaging: Tape and Reel; Mount: Surface Mount; Length: 3.2mm; Load Capacitance: 18pF; Max Operating Temperature: 70°C; Operating Frequency: 48 MHz; RoHS Compliant: Yes; Series: ABM8; Frequency Tolerance: 20ppm; Lead Free: Lead Free; Min Operating Temperature: -20°C; Case/Package: CSMD; Number of Pins: 4; Height: 0.031inch; ESR (Equivalent Series Resistance): 35R; Frequency: 48MHz; Radiation Hardening: No; Width: 0.098inch; Tolerance: 20ppm; Termination: SMD/SMT; Depth: 2.5mm; Resistor Type: Ceramic; REACH SVHC: No SVHC
Y2 = CMP-40224-000006-1: CRYSTAL 32.7680KHZ 12.5PF SMD; Manufacturer: ECS International; Frequency: 32.768kHz; Esr: 90kΩ; Tolerance: 20ppm; Device Class L1: Passive Components; Load Capacitance: 12.5pF; Temperature: -40°C to +85°C; ComponentLink2URL: https://ecsxtal.com/store/pdf/ECX-1210.pdf; Series: ECX-1210; Octopart: https://octopart.com/ecs-.327-12.5-1210-tr-ecs+international-81221340; ComponentLink2Description: Datasheet; Temperature Range Low: -40°C; Digikey Description: CRYSTAL 32.7680KHZ 12.5PF SMD; Lead Free: Yes; RoHS: TRUE; Device Class L3: Crystals; Automotive: No; Category: Crys; Height: 0.5mm; Manufacturer Part Number: ECS-.327-12.5-1210-TR; Temperature Range High: +85°C; Device Class L2: Crystals / Oscillators; Package: ECX-1210

## Sheet PWR_PROT.SchDoc
size B; SheetNumber: 3; SheetTotal: 9
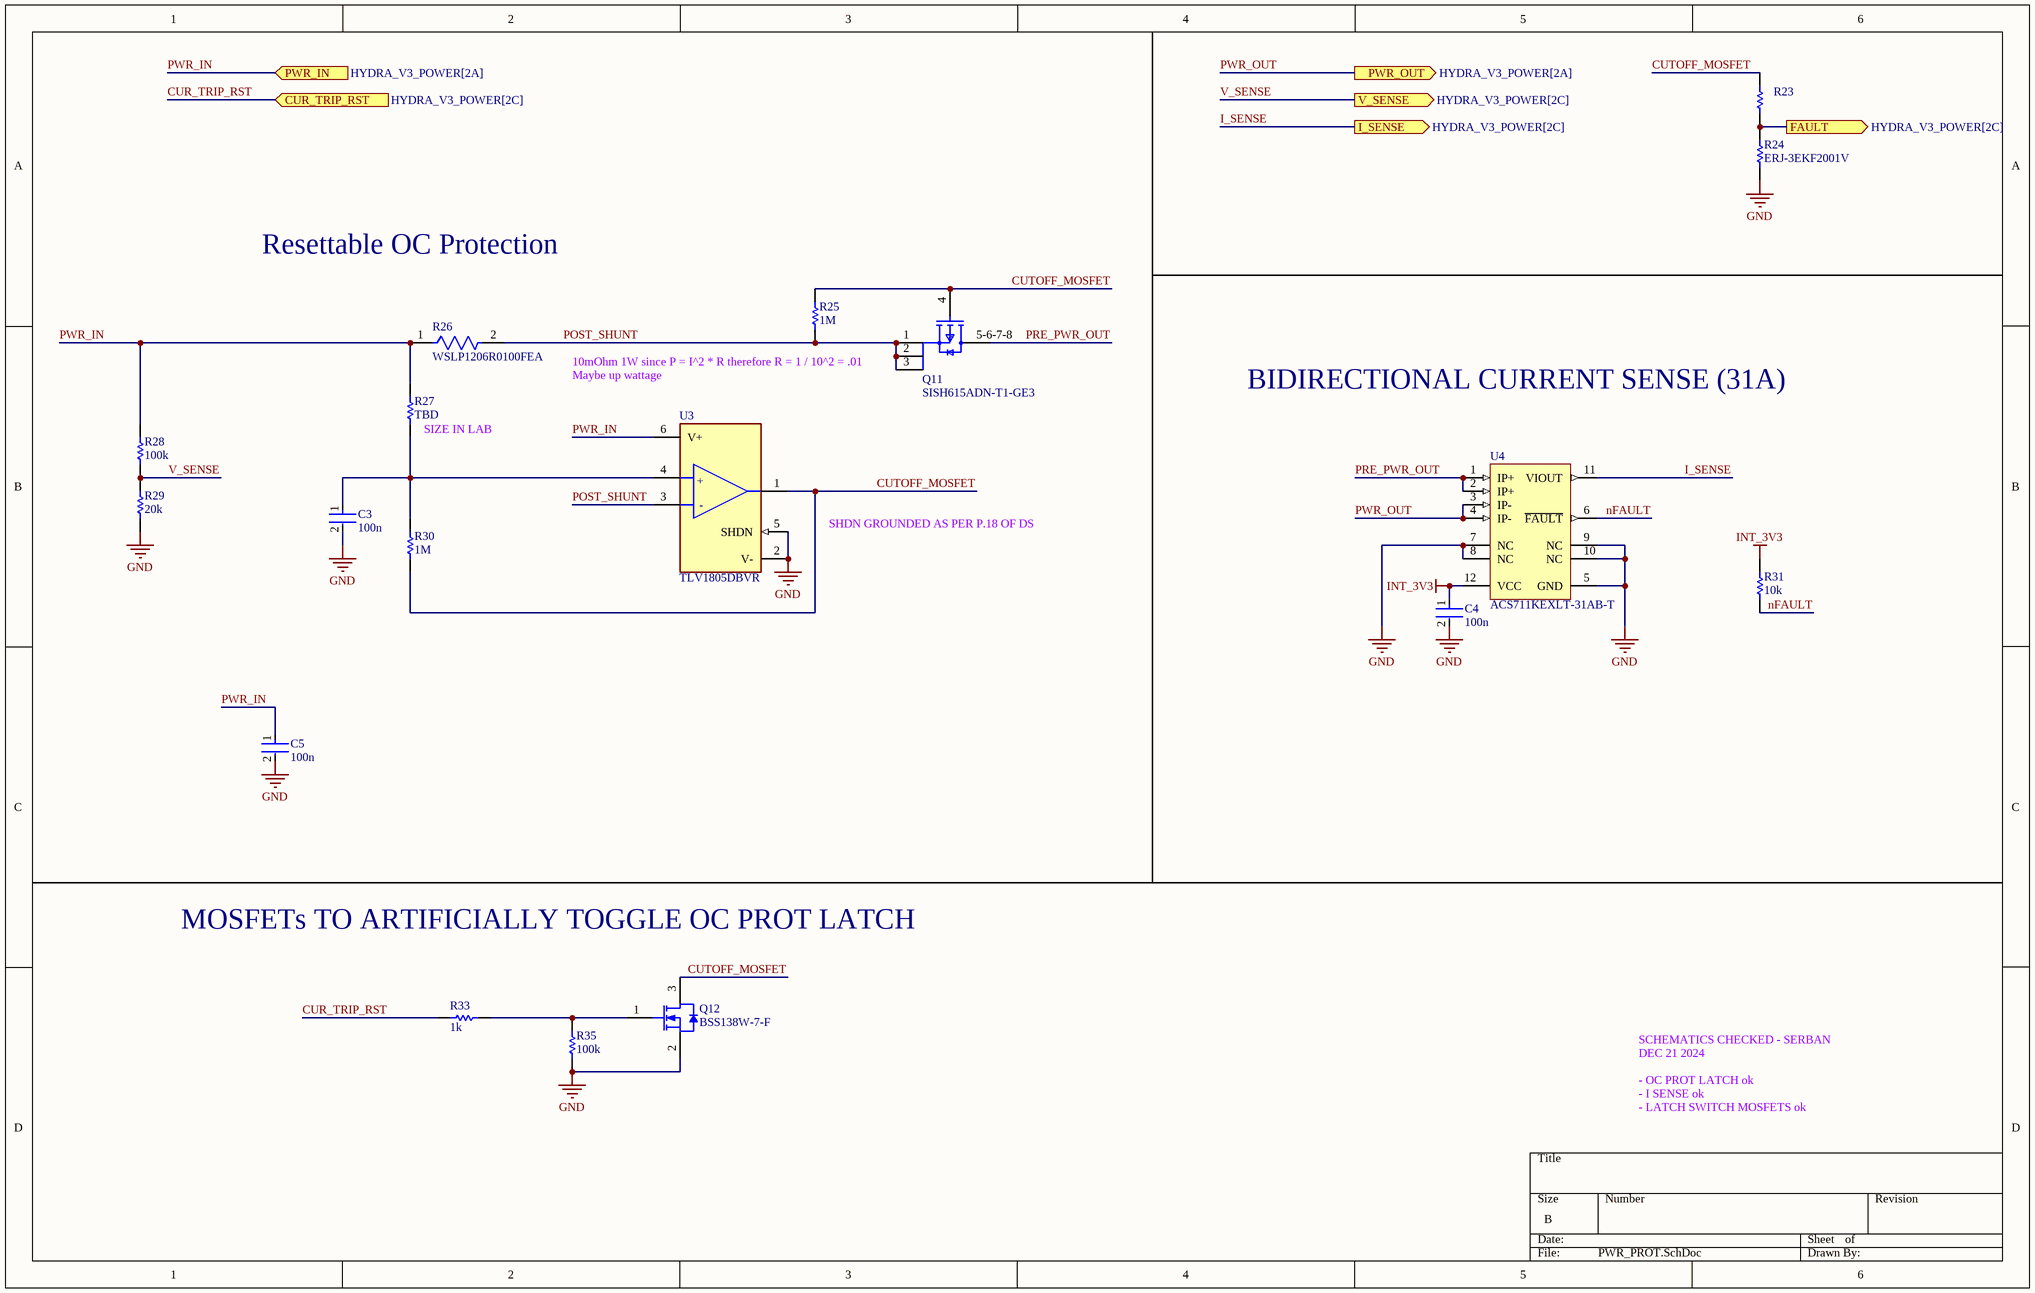
[diagram p5: PWR_PROT.SchDoc]

### Parts
C3  100n  [FP-0402-L_1_0_0_05-W_0_5-IPC_A]
C4  100n  [FP-0402-L_1_0_0_05-W_0_5-IPC_A]
C5  100n  [FP-0402-L_1_0_0_05-W_0_5-IPC_A]
Q11  SISH615ADN-T1-GE3  [SISH615ADN-T1-GE3-Footprint-1]
Q12  BSS138W-7-F  [DIOD-SOT323-3_V]
R23  ERJ3EKF1002V  [RESC1609X55X30LL15T15]  (value not drawn)
R24  ERJ-3EKF2001V  [RESC1608X55X30ML15T15]
R25  1M  [R0603B]
R26  WSLP1206R0100FEA  [FP-WSLP1206-FP_1_65x1_93x-MFG]
R27  TBD  [R0603B]
R28  100k  [R0603B]
R29  20k  [R0603B]
R30  1M  [R0603B]
R31  10k  [R0603B]
R33  1k  [R0603B]
R35  100k  [R0603B]
U3  TLV1805DBVR  [FP-DBV0006A-IPC_C]
U4  ACS711KEXLT-31AB-T  [ALEG-EX-12_V]

### Ports
CUR_TRIP_RST (in, see HYDRA_V3_POWER[2C]), FAULT (out, see HYDRA_V3_POWER[2C]), I_SENSE (out, see HYDRA_V3_POWER[2C]), PWR_IN (in, see HYDRA_V3_POWER[2A]), PWR_OUT (out, see HYDRA_V3_POWER[2A]), V_SENSE (out, see HYDRA_V3_POWER[2C])

### Nets
GND: C3.2 C4.2 C5.2 Q12.2(S) R24.1 R29.1 R35.1 U3.2(V-) U3.5(SHDN) U4.5(GND) U4.7(NC) U4.8(NC) U4.9(NC) U4.10(NC)
INT_3V3: C4.1 R31.2 U4.12(VCC)
CUR_TRIP_RST: R33.2 ; port CUR_TRIP_RST
CUTOFF_MOSFET: Q11.4(G) Q12.3(D) R23.1 R25.2 R30.1 U3.1(OUT)
EXT_VCC_PWR_FAULT: R23.2 R24.2 ; port FAULT
I_SENSE: U4.11(VIOUT) ; port I_SENSE  [project net EXT_VCC_I_SENSE]
nFAULT: R31.1 U4.6(~{FAULT})
POST_SHUNT: Q11.1(S) Q11.2(S) Q11.3(S) R25.1 R26.2 U3.3(-IN)
PRE_PWR_OUT: Q11.5-6-7-8(D) U4.1(IP+) U4.2(IP+)
PWR_IN: C5.1 R26.1 R27.2 R28.2 U3.6(V+) ; port PWR_IN
PWR_OUT: U4.3(IP-) U4.4(IP-) ; port PWR_OUT  [project net M1_PWR]
V_SENSE: R28.1 R29.2 ; port V_SENSE  [project net EXT_VCC_V_SENSE]
NetC3_1: C3.1 R27.1 R30.2 U3.4(+IN)
NetQ12_1: Q12.1(G) R33.1 R35.2

### Notes on the sheet
- Resettable OC Protection
- (near Q11) 10mOhm 1W since P = I^2 * R therefore R = 1 / 10^2 = .01
- (near R27) SIZE IN LAB
- Maybe up wattage
- BIDIRECTIONAL CURRENT SENSE (31A)
- SHDN GROUNDED AS PER P.18 OF DS
- MOSFETs TO ARTIFICIALLY TOGGLE OC PROT LATCH
- SCHEMATICS CHECKED - SERBAN
  DEC 21 2024
  - OC PROT LATCH ok
  - I SENSE ok
  - LATCH SWITCH MOSFETS ok
- (in symbol CMP-04896-000098-1) +; -

### Library data of the parts
C3-C5 = CMP-001-00058-1: as C19#1 on sheet STM32G473CET6_PINOUT; Min Operating Temperature: -55°C; Mounting Technology: Surface Mount; Pins: 2; Case/Package: 0402; RoHS Compliant: Yes; Max Operating Temperature: 85°C
Q11 = CMP-013-00018-2: Trans MOSFET P-CH 20V 22.1A 8-Pin PowerPAK 1212 EP T/R; Source: SISH615ADN-T1-GE3.SchLib; Design Item ID: CMP-013-00036-4; Component Type: Standard; Pins: 5
Q12 = CMP-2000-05968-1: as Q21 on sheet STM32G473CET6_PINOUT; Manufacturer URL: http://www.diodes.com/; Series: BSS138; Package Description: 3-Pin Small Outline Transistor, Body 2 x 1.25 mm, Pitch 0.65 mm; Mounting Technology: SurfaceMount; Product Category: MOSFET; RoHS: True; Maximum Operating Temperature: +150C; Height: 1mm; Length: 2.2mm; Technology: Si; Width: 1.35mm; Datasheet URL: http://www.diodes.com/_files/datasheets/ds30206.pdf; Manufacturer: DiodesIncorporated; Package / Case: SOT-323-3; Typical Turn-On Delay Time: 20ns; Transistor Polarity: N-Channel; Factory Pack Quantity: 3000; Packaging: Reel; Product: MOSFETSmallSignal; Datasheet Version: Rev. 11-2, 09/2013; Package Reference: SOT323; Minimum Operating Temperature: -55C; Mounting Style: SMD/SMT; Channel Mode: Enhancement
R23 = CMP-1012-00623-3: Chip Resistor, 10 KOhm, +/- 1%, 0.1 W, -55 to 155 degC, 0603 (1608 Metric), RoHS, Tape and Reel; Manufacturer: Panasonic; Voltage Rating: 75V; Case\/Package: 0603; Power Rating: 100mW; Resistance: 10KOhm; Temperature Coefficient: 100ppm\/degreesC; Number of Pins: 2; Package Reference: 603; Depth: 0.8mm; Mount: SurfaceMount; Package Description: 2-Pin Surface Mount Device, Body 1.6 x 0.85 mm; Datasheet Version: 02/2017; Length: 1.6mm; Lead Free: LeadFree; Height: 0.45mm; Number of Terminations: 2; Max Power Dissipation: 100mW; Min Operating Temperature: -55degC; Datasheet URL: https://industrial.panasonic.com/cdbs/www-data/pdf/RDA0000/AOA0000C304.pdf; Termination: SMD/SMT; Case Code (Metric): 1608; Case Code (Imperial): 0603; Tolerance: 1%; Max Operating Temperature: 155degC; RoHSCompliant: true; Voltage Rating (DC): 75V; Radiation Hardening: No; Packaging: TapeandReel; Composition: ThickFilm; Mounting Technology: SurfaceMount; Manufacturer URL: http://www.panasonic.com/; Width: 0.031inch; REACH SVHC: NoSVHC; Contact Plating: Tin; Military Standard: Not; Package Quantity: 1
R24 = CMP-2000-00317-1: Manufacturer: Panasonic; Part Number: ERJ-3EKF2001V
R25 R27-R31 R33 R35 = CMP-009-00002-14: Resistor
R26 = CMP-2003-04373-2: RES 0.01 OHM 1% 1W 1206; Temperature Coefficient: 75ppm/°C; Resistance: 10mR; Features: Moisture Resistant; Case/Package: 1206; Military Standard: Not; Case Code (Imperial): 1206; Power Rating: 1W; Number of Terminations: 2; Lead Free: Lead Free; Number of Pins: 2; Min Operating Temperature: -65°C; Weight: 0.000571oz; Radiation Hardening: No; Series: WSLP; Length: 3.2mm; Termination: SMD/SMT; Mount: Surface Mount; Size Code: 1206; Height: 0.035inch; Case Code (Metric): 3216; Resistance Tolerance: 1%; Contact Plating: Tin; Width: 0.063inch; Construction: Rectangular; Packaging: Tape and Reel; Package Quantity: 1; RoHS Compliant: Yes; Depth: 1.6mm; Tolerance: 1%; Max Operating Temperature: 170°C; Max Power Dissipation: 1W; Resistor Type: Metal Strip
U3 = CMP-04896-000098-1: 40V, RAIL-TO-RAIL INPUT, PUSH-PU
U4 = CMP-1557-00002-1: Hall Effect Linear Current Sensor with Overcurrent Fault Output for <100 V Isolation Applications, 3 to 5.5 V, -31 to 31 A IP, -40 to 125 degC, 12-Pin QFN (EX), RoHS, Tape and Reel; IP Max: 31 A; VCC Min: 3 V; -3dB Bandwidth: 0.1 MHz; VCC Max: 5.5 V; IP Min: -31 A; Mounting Technology: Surface Mount; DatasheetVersion: Rev. 3; Temperature Min: -40 degC; ComponentLink1Description: Manufacturer URL; Packing: Tape and Reel; PartNumber: ACS711KEXLT-31AB-T; Temperature Max: 125 degC; ComponentLink2Description: Datasheet; ComponentLink3Description: Package Specification; RoHS: TRUE; ComponentLink1URL: http://www.allegromicro.com/; ComponentLink2URL: http://www.allegromicro.com/~/media/Files/Datasheets/ACS711-Datasheet.ashx?la=en; PackageDescription: 12-Pin Quad Flat No-Lead, Body 3 x 3 mm, Height 0.8 mm; ComponentLink3URL: http://www.allegromicro.com/~/media/Files/Datasheets/ACS711-Datasheet.ashx?la=en

## Sheet CELL_SENSE.SchDoc
size A; SheetNumber: 7; SheetTotal: 9
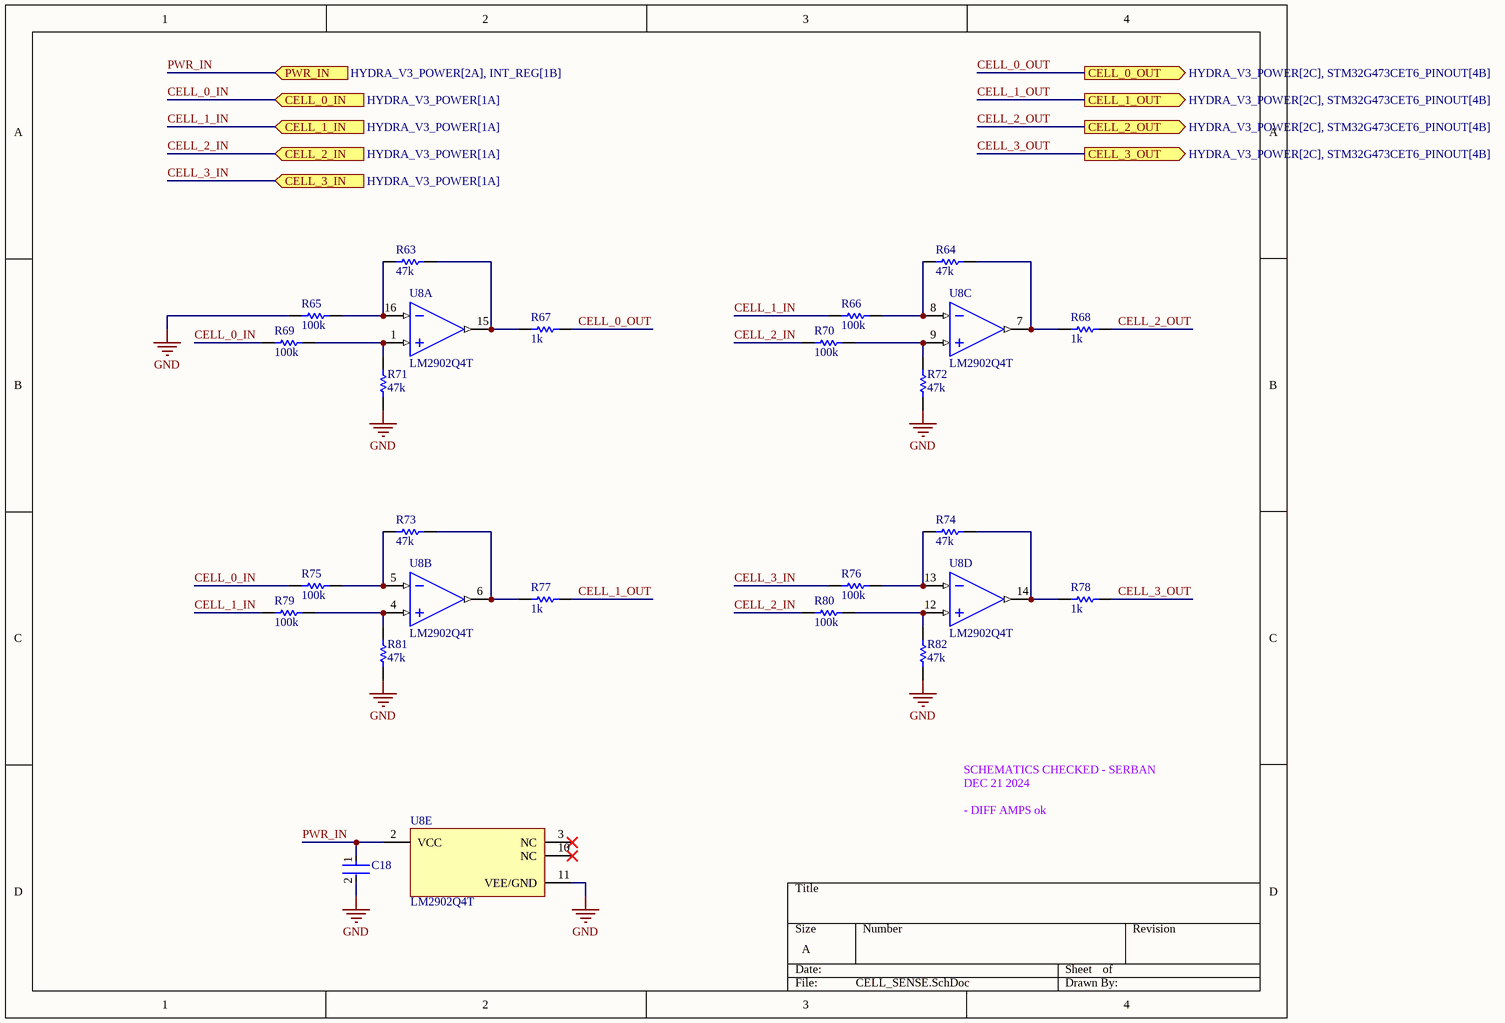
[diagram p6: CELL_SENSE.SchDoc]

### Parts
(Parts that share a designator on the sheet are numbered #1, #2 ... from top to bottom, then left to right.)
C18#1  100n  [FP-0402-L_1_0_0_05-W_0_5-IPC_A]  (value not drawn)
R63  47k  [R0603B]
R64  47k  [R0603B]
R65  100k  [R0603B]
R66  100k  [R0603B]
R67  1k  [R0603B]
R68  1k  [R0603B]
R69  100k  [R0603B]
R70  100k  [R0603B]
R71  47k  [R0603B]
R72  47k  [R0603B]
R73  47k  [R0603B]
R74  47k  [R0603B]
R75  100k  [R0603B]
R76  100k  [R0603B]
R77  1k  [R0603B]
R78  1k  [R0603B]
R79  100k  [R0603B]
R80  100k  [R0603B]
R81  47k  [R0603B]
R82  47k  [R0603B]
U8#1  LM2902Q4T  [QFN50P300X300X100_HS-17N]  (parts A,B,C,D,E of 5)

### Ports
CELL_0_IN (in, see HYDRA_V3_POWER[1A]), CELL_0_OUT (out, see HYDRA_V3_POWER[2C], STM32G473CET6_PINOUT[4B]), CELL_1_IN (in, see HYDRA_V3_POWER[1A]), CELL_1_OUT (out, see HYDRA_V3_POWER[2C], STM32G473CET6_PINOUT[4B]), CELL_2_IN (in, see HYDRA_V3_POWER[1A]), CELL_2_OUT (out, see HYDRA_V3_POWER[2C], STM32G473CET6_PINOUT[4B]), CELL_3_IN (in, see HYDRA_V3_POWER[1A]), CELL_3_OUT (out, see HYDRA_V3_POWER[2C], STM32G473CET6_PINOUT[4B]), PWR_IN (in, see HYDRA_V3_POWER[2A], INT_REG[1B])

### Nets
GND: C18#1.2 R65.2 R71.2 R72.2 R81.2 R82.2 U8#1.11(VEE/GND)
PWR_IN: C18#1.1 U8#1.2(VCC) ; port PWR_IN  [project net INT_PWR]
CELL_0_IN: R69.2 R75.2 ; port CELL_0_IN
CELL_0_OUT: R67.1 ; port CELL_0_OUT
CELL_1_IN: R66.2 R79.2 ; port CELL_1_IN
CELL_1_OUT: R77.1 ; port CELL_1_OUT
CELL_2_IN: R70.2 R80.2 ; port CELL_2_IN
CELL_2_OUT: R68.1 ; port CELL_2_OUT
CELL_3_IN: R76.2 ; port CELL_3_IN
CELL_3_OUT: R78.1 ; port CELL_3_OUT
NetR63_1: R63.1 R65.1 U8#1.16(IN1-)
NetR63_2: R63.2 R67.2 U8#1.15(OUT1)
NetR64_1: R64.1 R66.1 U8#1.8(IN3-)
NetR64_2: R64.2 R68.2 U8#1.7(OUT3)
NetR69_1: R69.1 R71.1 U8#1.1(IN1+)
NetR70_1: R70.1 R72.1 U8#1.9(IN3+)
NetR73_1: R73.1 R75.1 U8#1.5(IN2-)
NetR73_2: R73.2 R77.2 U8#1.6(OUT2)
NetR74_1: R74.1 R76.1 U8#1.13(IN4-)
NetR74_2: R74.2 R78.2 U8#1.14(OUT4)
NetR79_1: R79.1 R81.1 U8#1.4(IN2+)
NetR80_1: R80.1 R82.1 U8#1.12(IN4+)

Not connected (* = marked no-connect by the designer): U8#1 3(NC)* 10(NC)*

### Notes on the sheet
- SCHEMATICS CHECKED - SERBAN
  DEC 21 2024
  - DIFF AMPS ok

### Library data of the parts
C18#1 = CMP-001-00058-1: as C19#1 on sheet STM32G473CET6_PINOUT; Min Operating Temperature: -55°C; Mounting Technology: Surface Mount; Pins: 2; Case/Package: 0402; RoHS Compliant: Yes; Max Operating Temperature: 85°C
R63-R82 = CMP-009-00002-14: Resistor
U8#1 = CMP-014-00021-1: Operational Amplifier, 4 Func, 9000uV Offset-Max, BIPolar, PQCC16; Channels: 4; RoHS Compliant: Yes; Max Operating Temperature: 125°C; Case/Package: HVQCCN; Pins: 16; Min Operating Temperature: -40°C

## Sheet MOSFET_JUNCTION.SchDoc
size C; SheetNumber: 2; SheetTotal: 9
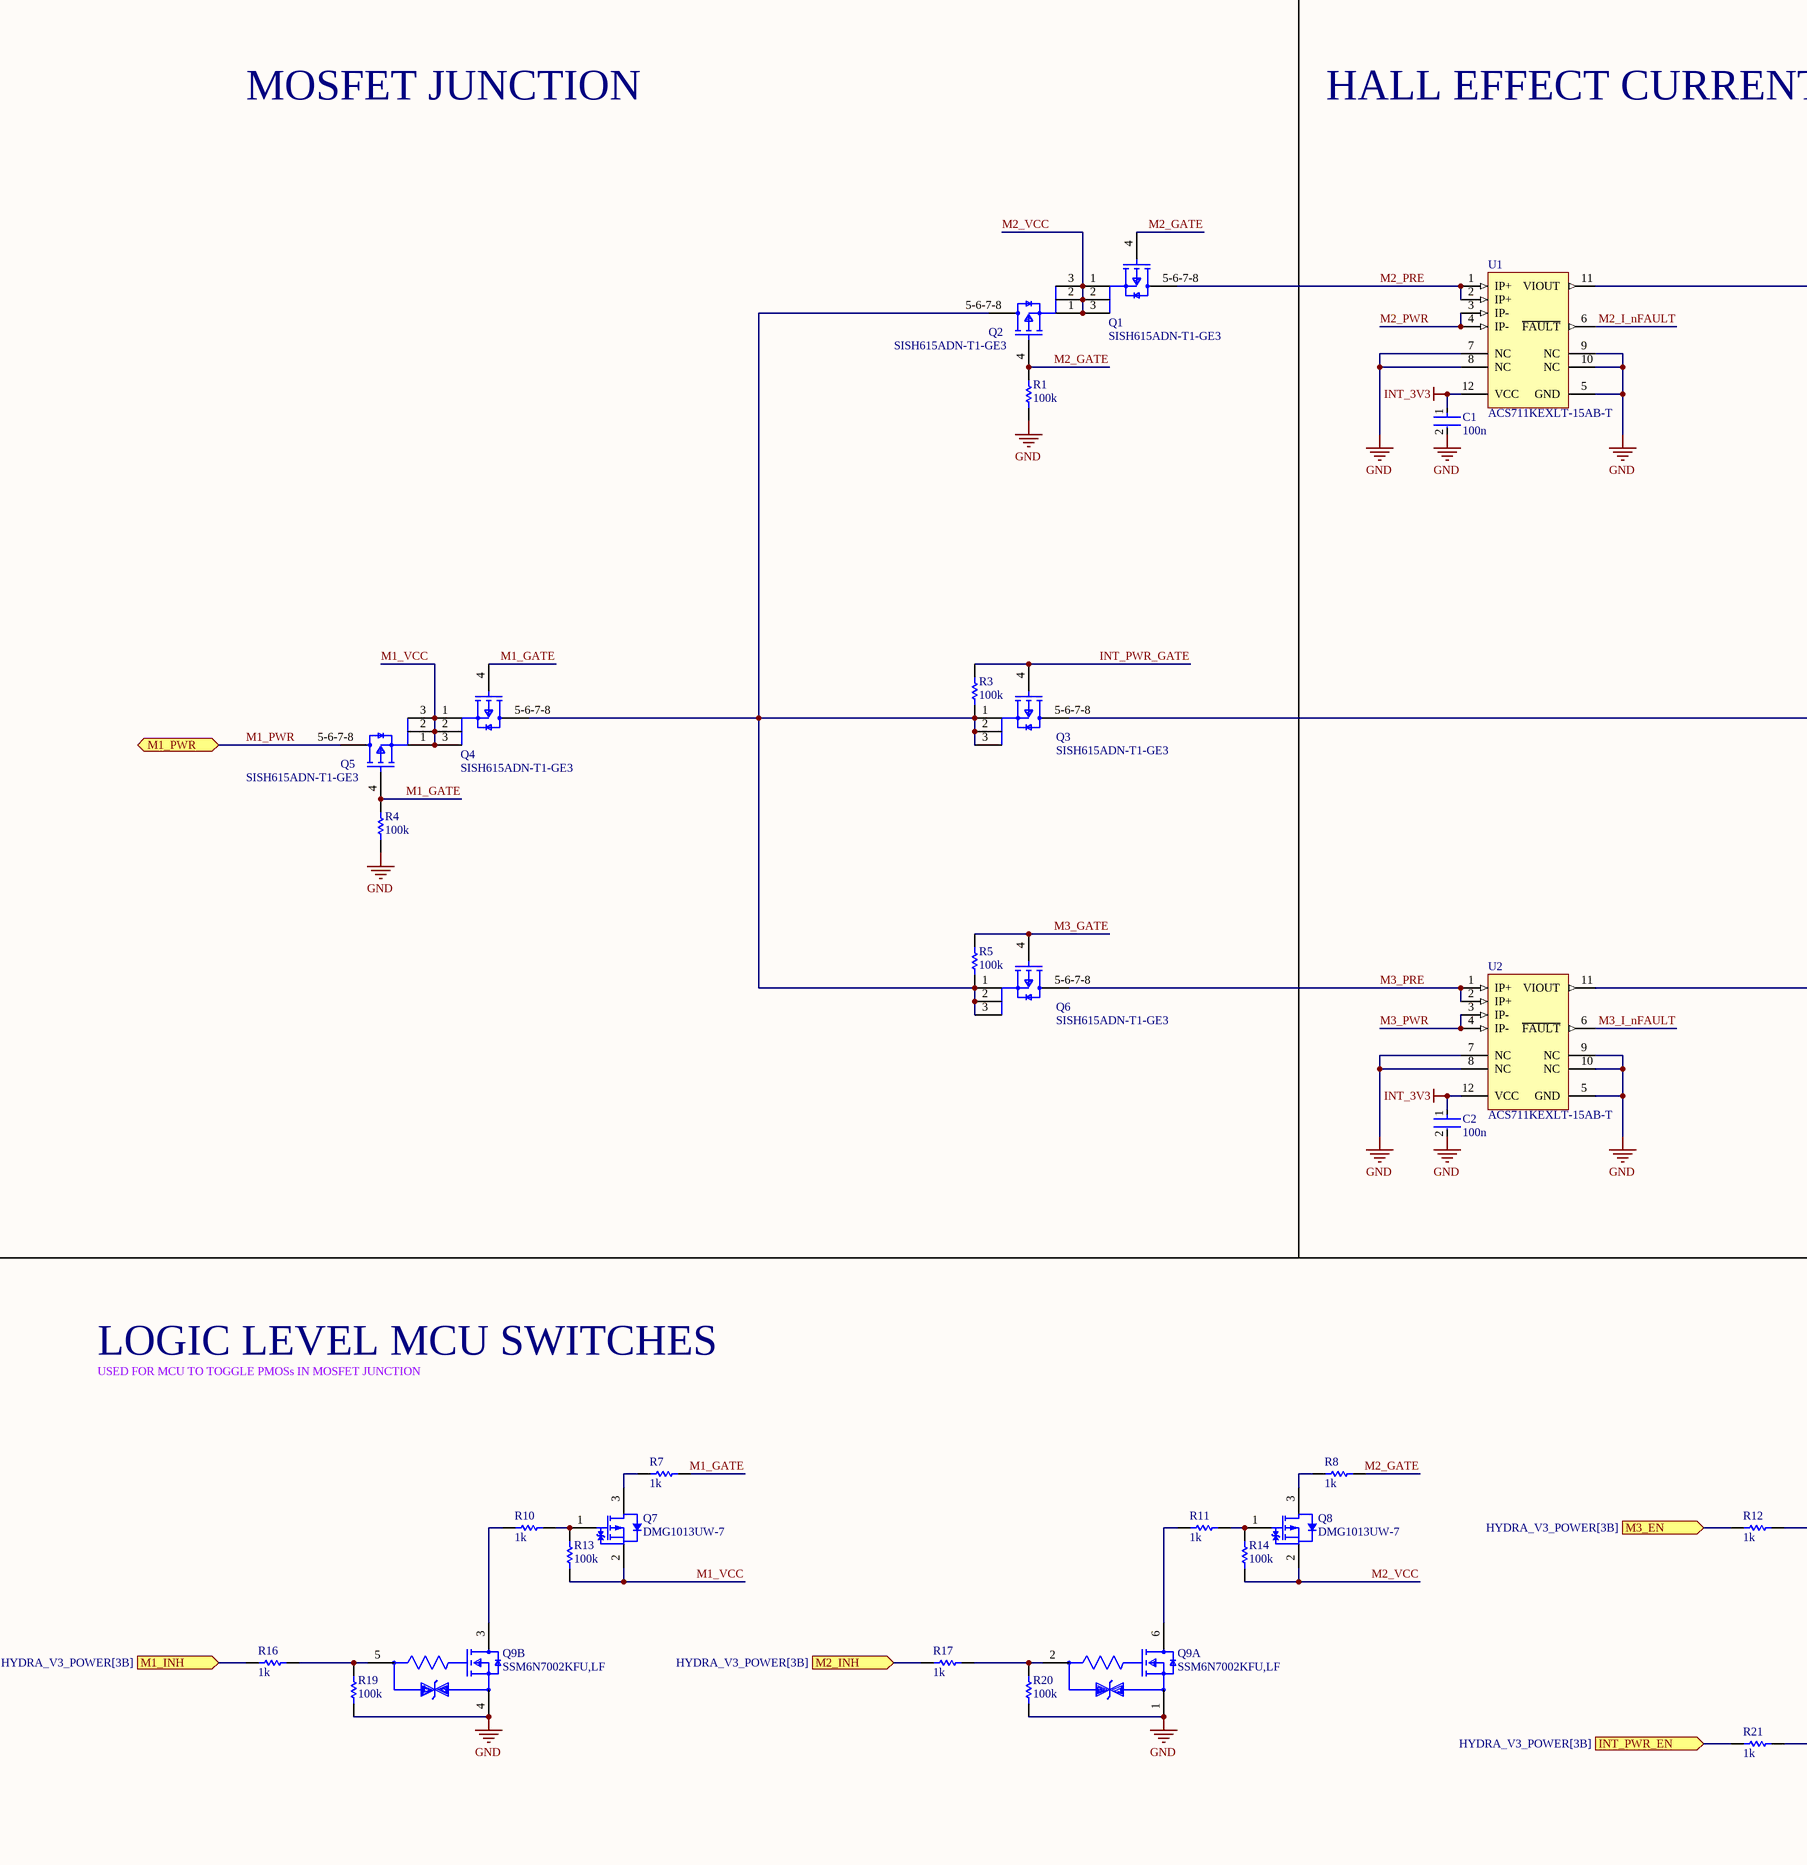
[diagram p7: MOSFET_JUNCTION.SchDoc, left]
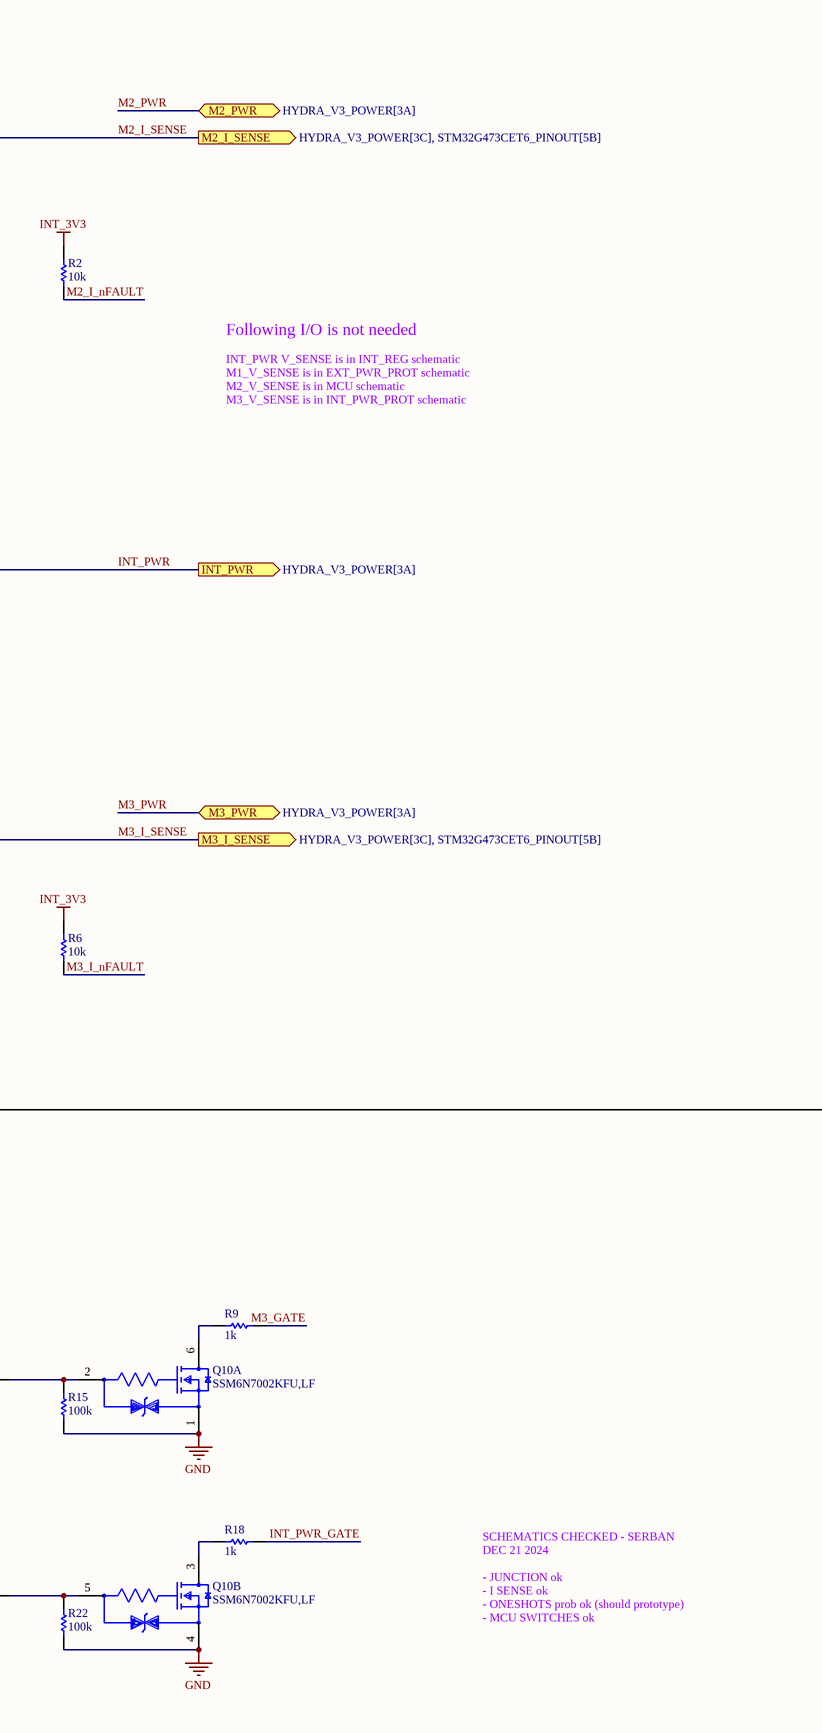
[diagram p8: MOSFET_JUNCTION.SchDoc, right]

### Parts
C1  100n  [FP-0402-L_1_0_0_05-W_0_5-IPC_A]
C2  100n  [FP-0402-L_1_0_0_05-W_0_5-IPC_A]
Q1  SISH615ADN-T1-GE3  [SISH615ADN-T1-GE3-Footprint-1]
Q2  SISH615ADN-T1-GE3  [SISH615ADN-T1-GE3-Footprint-1]
Q3  SISH615ADN-T1-GE3  [SISH615ADN-T1-GE3-Footprint-1]
Q4  SISH615ADN-T1-GE3  [SISH615ADN-T1-GE3-Footprint-1]
Q5  SISH615ADN-T1-GE3  [SISH615ADN-T1-GE3-Footprint-1]
Q6  SISH615ADN-T1-GE3  [SISH615ADN-T1-GE3-Footprint-1]
Q7  DMG1013UW-7  [DIOD-SOT323-3_V]
Q8  DMG1013UW-7  [DIOD-SOT323-3_V]
Q9  SSM6N7002KFU,LF  [FP-SSOP6-P-0_65A-MFG]  (parts A,B of 2)
Q10  SSM6N7002KFU,LF  [FP-SSOP6-P-0_65A-MFG]  (parts A,B of 2)
R1  100k  [R0603B]
R2  10k  [R0603B]
R3  100k  [R0603B]
R4  100k  [R0603B]
R5  100k  [R0603B]
R6  10k  [R0603B]
R7  1k  [R0603B]
R8  1k  [R0603B]
R9  1k  [R0603B]
R10  1k  [R0603B]
R11  1k  [R0603B]
R12  1k  [R0603B]
R13  100k  [R0603B]
R14  100k  [R0603B]
R15  100k  [R0603B]
R16  1k  [R0603B]
R17  1k  [R0603B]
R18  1k  [R0603B]
R19  100k  [R0603B]
R20  100k  [R0603B]
R21  1k  [R0603B]
R22  100k  [R0603B]
U1  ACS711KEXLT-15AB-T  [ALEG-EX-12_V]
U2  ACS711KEXLT-15AB-T  [ALEG-EX-12_V]

### Ports
INT_PWR (out, see HYDRA_V3_POWER[3A]), INT_PWR_EN (in, see HYDRA_V3_POWER[3B]), M1_INH (in, see HYDRA_V3_POWER[3B]), M1_PWR (bidir, see HYDRA_V3_POWER[3A]), M2_I_SENSE (out, see HYDRA_V3_POWER[3C], STM32G473CET6_PINOUT[5B]), M2_INH (in, see HYDRA_V3_POWER[3B]), M2_PWR (bidir, see HYDRA_V3_POWER[3A]), M3_EN (in, see HYDRA_V3_POWER[3B]), M3_I_SENSE (out, see HYDRA_V3_POWER[3C], STM32G473CET6_PINOUT[5B]), M3_PWR (bidir, see HYDRA_V3_POWER[3A])

### Nets
GND: C1.2 C2.2 Q9.1(Source1) Q9.4(Source2) Q10.1(Source1) Q10.4(Source2) R1.1 R4.1 R15.1 R19.1 R20.1 R22.1 U1.5(GND) U1.7(NC) U1.8(NC) U1.9(NC) U1.10(NC) U2.5(GND) U2.7(NC) U2.8(NC) U2.9(NC) U2.10(NC)
INT_3V3: C1.1 C2.1 R2.2 R6.2 U1.12(VCC) U2.12(VCC)
INT_PWR: Q3.5-6-7-8(D) ; port INT_PWR
CAN_INH: R21.2 ; port INT_PWR_EN
INT_PWR_GATE: Q3.4(G) R3.2 R18.1
M1_ENABLE: R16.2 ; port M1_INH
M1_GATE: Q4.4(G) Q5.4(G) R4.2 R7.1
M1_PWR: Q5.5-6-7-8(D) ; port M1_PWR
M1_VCC: Q4.1(S) Q4.2(S) Q4.3(S) Q5.1(S) Q5.2(S) Q5.3(S) Q7.2(S) R13.2
M2_ENABLE: R17.2 ; port M2_INH
M2_GATE: Q1.4(G) Q2.4(G) R1.2 R8.1
M2_I_nFAULT: R2.1 U1.6(~{FAULT})
M2_I_SENSE: U1.11(VIOUT) ; port M2_I_SENSE
M2_PRE: Q1.5-6-7-8(D) U1.1(IP+) U1.2(IP+)
M2_PWR: U1.3(IP-) U1.4(IP-) ; port M2_PWR
M2_VCC: Q1.1(S) Q1.2(S) Q1.3(S) Q2.1(S) Q2.2(S) Q2.3(S) Q8.2(S) R14.2
M3_ENABLE: R12.2 ; port M3_EN
M3_GATE: Q6.4(G) R5.2 R9.1
M3_I_nFAULT: R6.1 U2.6(~{FAULT})
M3_I_SENSE: U2.11(VIOUT) ; port M3_I_SENSE
M3_PRE: Q6.5-6-7-8(D) U2.1(IP+) U2.2(IP+)
M3_PWR: U2.3(IP-) U2.4(IP-) ; port M3_PWR
NetQ2_5-6-7-8: Q2.5-6-7-8(D) Q3.1(S) Q3.2(S) Q3.3(S) Q4.5-6-7-8(D) Q6.1(S) Q6.2(S) Q6.3(S) R3.1 R5.1
NetQ7_1: Q7.1(G) R10.1 R13.1
NetQ7_3: Q7.3(D) R7.2
NetQ8_1: Q8.1(G) R11.1 R14.1
NetQ8_3: Q8.3(D) R8.2
NetQ9_2: Q9.2(Gate1) R17.1 R20.2
NetQ9_3: Q9.3(Drain2) R10.2
NetQ9_5: Q9.5(Gate2) R16.1 R19.2
NetQ9_6: Q9.6(Drain1) R11.2
NetQ10_2: Q10.2(Gate1) R12.1 R15.2
NetQ10_3: Q10.3(Drain2) R18.2
NetQ10_5: Q10.5(Gate2) R21.1 R22.2
NetQ10_6: Q10.6(Drain1) R9.2

### Notes on the sheet
- MOSFET JUNCTION
- HALL EFFECT CURRENT SENSE
- INT_PWR V_SENSE is in INT_REG schematic
- M1_V_SENSE is in EXT_PWR_PROT schematic
- M2_V_SENSE is in MCU schematic
- Following I/O is not needed
- M3_V_SENSE is in INT_PWR_PROT schematic
- LOGIC LEVEL MCU SWITCHES
- USED FOR MCU TO TOGGLE PMOSs IN MOSFET JUNCTION
- SCHEMATICS CHECKED - SERBAN
  DEC 21 2024
  - JUNCTION ok
  - I SENSE ok
  - ONESHOTS prob ok (should prototype)
  - MCU SWITCHES ok

### Library data of the parts
C1 C2 = CMP-001-00058-1: as C19#1 on sheet STM32G473CET6_PINOUT; Min Operating Temperature: -55°C; Mounting Technology: Surface Mount; Pins: 2; Case/Package: 0402; RoHS Compliant: Yes; Max Operating Temperature: 85°C
Q1-Q6 = CMP-013-00018-2: as Q11 on sheet PWR_PROT; Source: SISH615ADN-T1-GE3.SchLib; Design Item ID: CMP-013-00036-4; Component Type: Standard; Pins: 5
Q7 Q8 = CMP-2000-06170-1: as Q20 on sheet STM32G473CET6_PINOUT; Package Reference: SOT323; Datasheet Version: Rev. 3-2, 09/2013; Package Description: 3-Pin Small Outline Transistor, Body 2 x 1.25 mm, Pitch 0.65 mm; Mounting Technology: SurfaceMount; Manufacturer URL: http://www.diodes.com/; Datasheet URL: http://www.diodes.com/_files/datasheets/ds31861.pdf; Channel Type: P-Channel
Q9 Q10 = CMP-35916-000009-1: MOSFET 2N-CH 60V 0.3A; Input Capacitance: 40pF; Continuous Drain Current (ID): 300mA; Max Power Dissipation: 285mW; FET Type: 2 N-Channel; Rds On Max: 1.5R; Mount: Surface Mount; Drain to Source Voltage (Vdss): 60V; Packaging: Tape and Reel
R1-R22 = CMP-009-00002-14: Resistor
U1 U2 = CMP-1557-00001-1: Hall Effect Linear Current Sensor with Overcurrent Fault Output for <100 V Isolation Applications, 3 to 5.5 V, -15.5 to 15.5 A IP, -40 to 125 degC, 12-Pin QFN (EX), RoHS, Tape and Reel; VCC Max: 5.5 V; IP Max: 15.5 A; VCC Min: 3 V; IP Min: -15.5 A; -3dB Bandwidth: 0.1 MHz; PackageDescription: 12-Pin Quad Flat No-Lead, Body 3 x 3 mm, Height 0.8 mm; ComponentLink1URL: http://www.allegromicro.com/; Packing: Tape and Reel; ComponentLink2URL: http://www.allegromicro.com/~/media/Files/Datasheets/ACS711-Datasheet.ashx?la=en; DatasheetVersion: Rev. 3; PartNumber: ACS711KEXLT-15AB-T; ComponentLink2Description: Datasheet; ComponentLink3URL: http://www.allegromicro.com/~/media/Files/Datasheets/ACS711-Datasheet.ashx?la=en; RoHS: TRUE; ComponentLink1Description: Manufacturer URL; ComponentLink3Description: Package Specification; Temperature Max: 125 degC; Mounting Technology: Surface Mount; Temperature Min: -40 degC

## Sheet INT_REG.SchDoc
size A; SheetNumber: 4; SheetTotal: 9
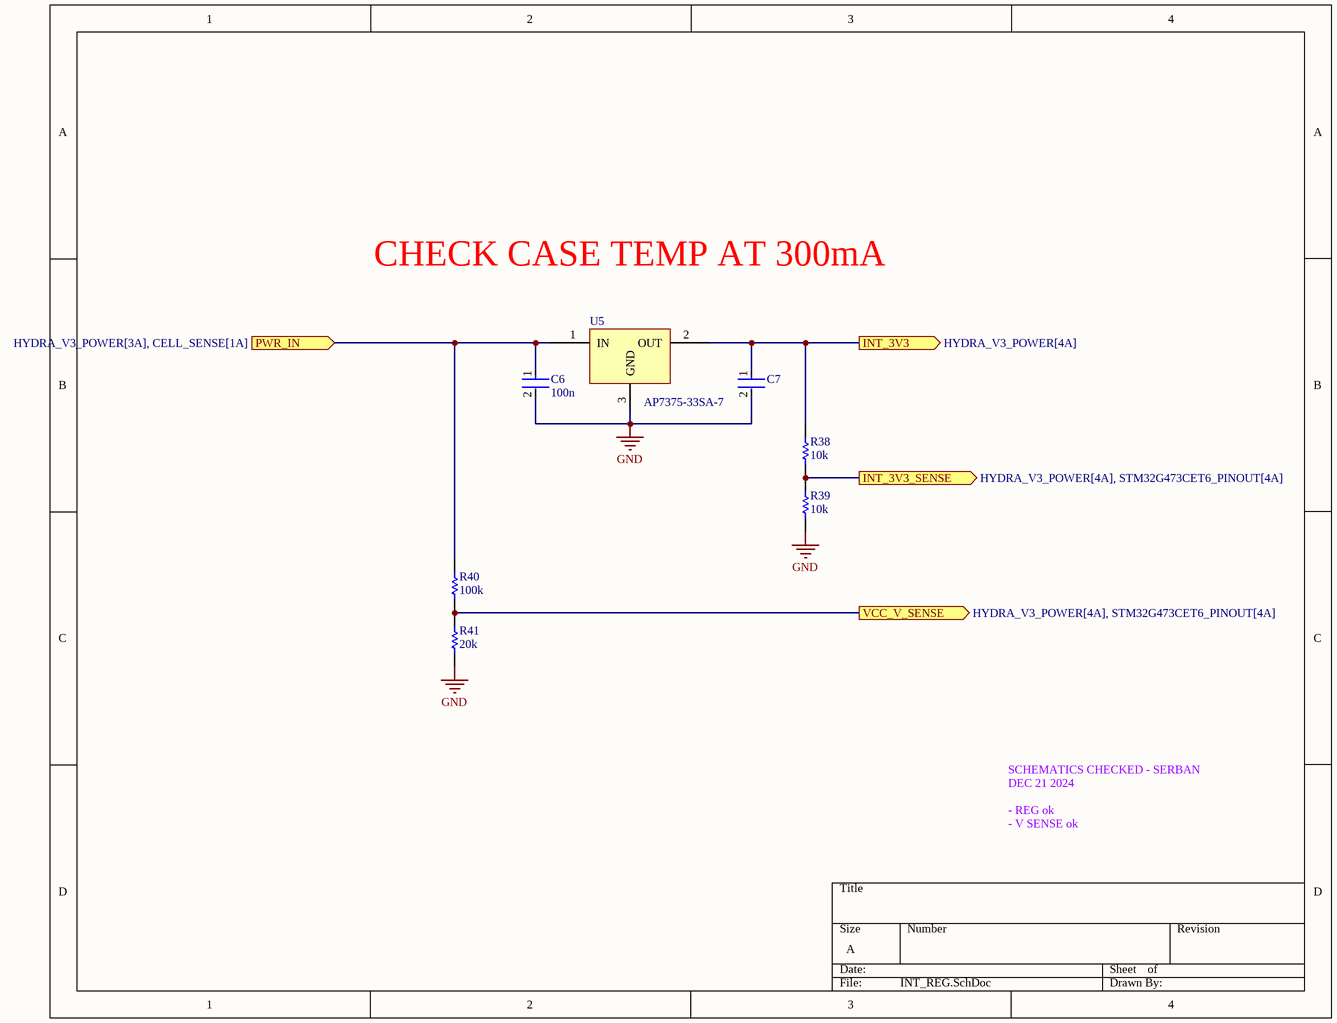
[diagram p9: INT_REG.SchDoc]

### Parts
(Parts that share a designator on the sheet are numbered #1, #2 ... from top to bottom, then left to right.)
C6  100n  [FP-0402-L_1_0_0_05-W_0_5-IPC_A]
C7  GRM188R61E106KA73D  [FP-GRM188-0_2-IPC_A]  (value not drawn)
R38#1  10k  [R0603B]
R39#1  10k  [R0603B]
R40#1  100k  [R0603B]
R41#1  20k  [R0603B]
U5  AP7375-33SA-7  [SOT90P285X110-3N]

### Ports
INT_3V3 (out, see HYDRA_V3_POWER[4A]), INT_3V3_SENSE (out, see HYDRA_V3_POWER[4A], STM32G473CET6_PINOUT[4A]), PWR_IN (in, see HYDRA_V3_POWER[3A], CELL_SENSE[1A]), VCC_V_SENSE (out, see HYDRA_V3_POWER[4A], STM32G473CET6_PINOUT[4A])

### Nets
GND: C6.2 C7.2 R39#1.1 R41#1.1 U5.3(GND)
INT_3V3: C7.1 R38#1.2 U5.2(OUT) ; port INT_3V3
INT_PWR: C6.1 R40#1.2 U5.1(IN) ; port PWR_IN
INT_3V3_SENSE: R38#1.1 R39#1.2 ; port INT_3V3_SENSE
VCC_V_SENSE: R40#1.1 R41#1.2 ; port VCC_V_SENSE

### Notes on the sheet
- CHECK CASE TEMP AT 300mA
- SCHEMATICS CHECKED - SERBAN
  DEC 21 2024
  - REG ok
  - V SENSE ok

### Library data of the parts
C6 = CMP-001-00058-1: as C19#1 on sheet STM32G473CET6_PINOUT; Min Operating Temperature: -55°C; Mounting Technology: Surface Mount; Pins: 2; Case/Package: 0402; RoHS Compliant: Yes; Max Operating Temperature: 85°C
C7 = CMP-06035-045268-1: Chip Multilayer Ceramic Capacitors for General Purpose, 0603, 10uF, X5R, 15%, 10%, 25V; Case/Package: 0603
R38#1 R39#1 R40#1 R41#1 = CMP-009-00002-14: Resistor
U5 = CMP-019-00039-1: LDO Regulator Pos 3.3V 0.3A 3-Pin SOT-23 T/R

## Sheet HYDRA_REGULATORS.SchDoc
size B; SheetNumber: 5; SheetTotal: 9
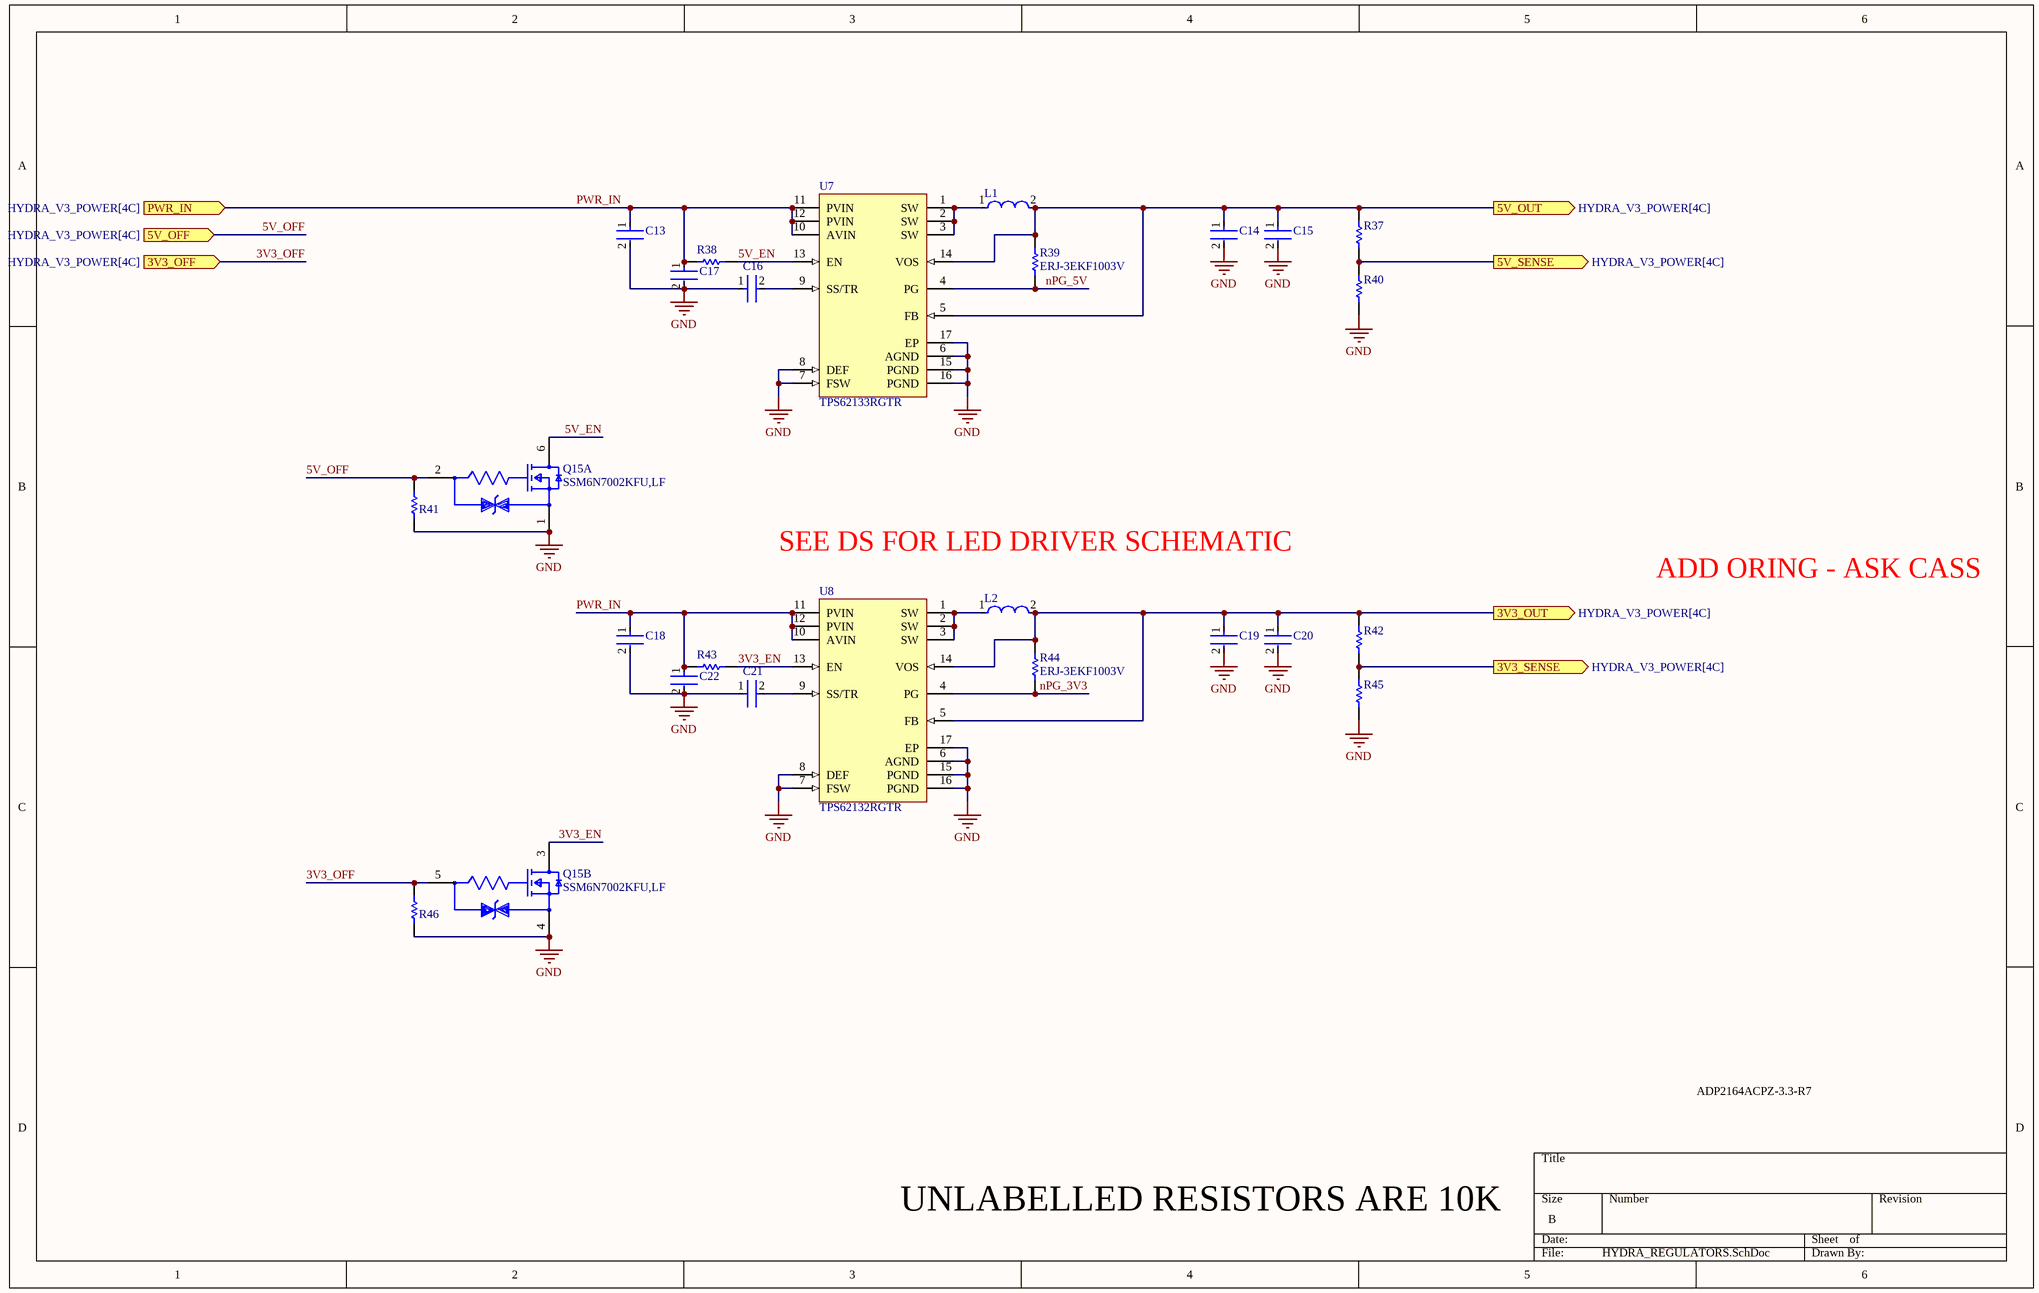
[diagram p10: HYDRA_REGULATORS.SchDoc]

### Parts
(Parts that share a designator on the sheet are numbered #1, #2 ... from top to bottom, then left to right.)
C13  TMK212BBJ106KG-T  [FP-0805-L_2_0_0_2-W_1_25-MFG]  (value not drawn)
C14  GRM21BR61E226ME44L  [FP-GRM21B-0_2-e0_2_0_7-IPC_B]  (value not drawn)
C15  TMK212BBJ106KG-T  [FP-0805-L_2_0_0_2-W_1_25-MFG]  (value not drawn)
C16  CC0402KRX7R9BB332  [FP-CC0402-MFG]  (value not drawn)
C17  GRM188R71H104KA93D  [FP-0402-L_1_0_0_05-W_0_5-IPC_A]  (value not drawn)
C18#2  TMK212BBJ106KG-T  [FP-0805-L_2_0_0_2-W_1_25-MFG]  (value not drawn)
C19#2  GRM21BR61E226ME44L  [FP-GRM21B-0_2-e0_2_0_7-IPC_B]  (value not drawn)
C20#2  TMK212BBJ106KG-T  [FP-0805-L_2_0_0_2-W_1_25-MFG]  (value not drawn)
C21#2  CC0402KRX7R9BB332  [FP-CC0402-MFG]  (value not drawn)
C22#2  GRM188R71H104KA93D  [FP-0402-L_1_0_0_05-W_0_5-IPC_A]  (value not drawn)
L1  IHLP1212BZER2R2M11  [FP-IHLP-1212BZ-11-MFG]  (value not drawn)
L2  IHLP1212BZER2R2M11  [FP-IHLP-1212BZ-11-MFG]  (value not drawn)
Q15  SSM6N7002KFU,LF  [FP-SSOP6-P-0_65A-MFG]  (parts A,B of 2)
R37  ERJ3EKF1002V  [RESC1609X55X30LL15T15]  (value not drawn)
R38#2  ERJ3EKF1002V  [RESC1609X55X30LL15T15]  (value not drawn)
R39#2  ERJ-3EKF1003V  [RESC1608X55X30ML15T15]
R40#2  ERJ3EKF1002V  [RESC1609X55X30LL15T15]  (value not drawn)
R41#2  ERJ3EKF1002V  [RESC1609X55X30LL15T15]  (value not drawn)
R42  ERJ3EKF1002V  [RESC1609X55X30LL15T15]  (value not drawn)
R43  ERJ3EKF1002V  [RESC1609X55X30LL15T15]  (value not drawn)
R44  ERJ-3EKF1003V  [RESC1608X55X30ML15T15]
R45  ERJ3EKF1002V  [RESC1609X55X30LL15T15]  (value not drawn)
R46  ERJ3EKF1002V  [RESC1609X55X30LL15T15]  (value not drawn)
U7  TPS62133RGTR  [RGT0016C_V]
U8#2  TPS62132RGTR  [RGT0016C_V]

### Ports
3V3_OFF (in, see HYDRA_V3_POWER[4C]), 3V3_OUT (out, see HYDRA_V3_POWER[4C]), 3V3_SENSE (out, see HYDRA_V3_POWER[4C]), 5V_OFF (in, see HYDRA_V3_POWER[4C]), 5V_OUT (out, see HYDRA_V3_POWER[4C]), 5V_SENSE (out, see HYDRA_V3_POWER[4C]), PWR_IN (in, see HYDRA_V3_POWER[4C])

### Nets
GND: C13.2 C14.2 C15.2 C16.1 C17.2 C18#2.2 C19#2.2 C20#2.2 C21#2.1 C22#2.2 Q15.1(Source1) Q15.4(Source2) R40#2.1 R41#2.1 R45.1 R46.1 U7.6(AGND) U7.7(FSW) U7.8(DEF) U7.15(PGND) U7.16(PGND) U7.17(EP) U8#2.6(AGND) U8#2.7(FSW) U8#2.8(DEF) U8#2.15(PGND) U8#2.16(PGND) U8#2.17(EP)
3V3_EN: Q15.3(Drain2) R43.2 U8#2.13(EN)
3V3_OFF: Q15.5(Gate2) R46.2 ; port 3V3_OFF
5V_EN: Q15.6(Drain1) R38#2.2 U7.13(EN)
5V_OFF: Q15.2(Gate1) R41#2.2 ; port 5V_OFF
HYDRA_3V3_SENSE: R42.1 R45.2 ; port 3V3_SENSE
HYDRA_5V_SENSE: R37.1 R40#2.2 ; port 5V_SENSE
nPG_3V3: R44.1 U8#2.4(PG)
nPG_5V: R39#2.1 U7.4(PG)
PWR_IN: C13.1 C17.1 C18#2.1 C22#2.1 R38#2.1 R43.1 U7.10(AVIN) U7.11(PVIN) U7.12(PVIN) U8#2.10(AVIN) U8#2.11(PVIN) U8#2.12(PVIN) ; port PWR_IN  [project net M3_PWR]
NetC14_1: C14.1 C15.1 L1.2 R37.2 R39#2.2 U7.5(FB) U7.14(VOS) ; port 5V_OUT
NetC16_2: C16.2 U7.9(SS/TR)
NetC19#2_1: C19#2.1 C20#2.1 L2.2 R42.2 R44.2 U8#2.5(FB) U8#2.14(VOS) ; port 3V3_OUT
NetC21#2_2: C21#2.2 U8#2.9(SS/TR)
NetL1_1: L1.1 U7.1(SW) U7.2(SW) U7.3(SW)
NetL2_1: L2.1 U8#2.1(SW) U8#2.2(SW) U8#2.3(SW)

### Notes on the sheet
- SEE DS FOR LED DRIVER SCHEMATIC
- ADD ORING - ASK CASS
- ADP2164ACPZ-3.3-R7
- UNLABELLED RESISTORS ARE 10K

### Library data of the parts
C13 C15 C18#2 C20#2 = CMP-14477-000079-3: Multilayer Ceramic Capacitor 10uF 25V X5R 10% SMD 0805 T/R; Voltage: 16V; Dielectric: X7R; Number of Pins: 2; Width: 0.049inch; REACH SVHC: No SVHC; Packaging: Tape and Reel; Max Operating Temperature: 85°C; Length: 0.079inch; Termination: SMD/SMT; RoHS Compliant: Yes; Thickness: 0.053inch; Case/Package: 0805; Case Code (Imperial): 0805; Capacitance: 10uF; Lead Free: Lead Free; Voltage Rating: 25V; Resistor Type: Ceramic; Voltage Rating (DC): 25V; Case Code (Metric): 2012; Mount: Surface Mount; Package Quantity: 1; Height: 1.25mm; Series: M; Tolerance: 10%; Min Operating Temperature: -55°C
C14 C19#2 = CMP-2007-03222-3: Chip Multilayer Ceramic Capacitors for General Purpose, 0805, 22uF, X5R, 15%, 20%, 25V; Case/Package: 0805; Depth: 1.25mm; Resistor Type: Ceramic; Voltage Rating: 25V; Lead Free: Lead Free; Voltage Rating (DC): 25V; Case Code (Metric): 2012; Thickness: 0.057inch; REACH SVHC: No SVHC; Material: Ceramic; Tolerance: 20%; Length: 2mm; Capacitance: 22uF; Case Code (Imperial): 0805; Max Operating Temperature: 85°C; Termination: SMD/SMT; Weight: 0.000335oz; Dielectric: X5R; Packaging: Tape and Reel; Voltage: 25V; Package Quantity: 3000; Height: 1.25mm; Mount: Surface Mount; Width: 1.25mm; Min Operating Temperature: -55°C
C16 C21#2 = CMP-1034-01779-2: CAP CER 3300PF 50V X7R 0402; Manufacturer: YAGEO; Temperature Coefficient: 30ppm/°C; Material: Ceramic; Value: 3.3 nF; Tolerance: 0.1; Automotive Grade: NA; ComponentLink2Description: Datasheet; ComponentLink2URL: http://www.yageo.com/documents/recent/UPY-GP_NP0_16V-to-50V_16.pdf; Package: CC0402; Temperature Range High: +125°C; Ipc Land Pattern Name: CAPC10050X50; Octopart: https://octopart.com/cc0402krx7r9bb332-yageo-192887; RoHS: TRUE; Automotive: No; Lead Free: Yes; Temperature Characteristic: X7R; Temperature: -55°C to +125°C; Height: 0.55mm; Category: Cap; Footprint Url: http://www.yageo.com/exep/pages/download/literatures/UPY-C_GEN_24.pdf; Device Class L2: Capacitors; Device Class L3: Ceramic Capacitors; Digikey Description: CAP CER 3300PF 50V X7R 0402; Temperature Range Low: -55°C; Manufacturer Part Number: CC0402KRX7R9BB332; Voltage Rating: 50 V; Mouser Description: Multilayer Ceramic Capacitors MLCC - SMD/SMT 3.3nF 50V X7R 10%; Device Class L1: Passive Components; Capacitance: 3.3 nF
C17 C22#2 = CMP-001-00058-1: as C19#1 on sheet STM32G473CET6_PINOUT; Min Operating Temperature: -55°C; Mounting Technology: Surface Mount; Pins: 2; Case/Package: 0402; RoHS Compliant: Yes; Max Operating Temperature: 85°C
L1 L2 = CMP-02424-000689-1: FIXED IND 2.2UH 3A 46 MOHM SMD; DC Resistance (DCR): 46mR; Inductance Tolerance: 20%; Saturation Current: 3.3A; Self Resonant Frequency: 55MHz; Core Material: Metal; Shielding: Shielded; Test Frequency: 100kHz; RMS Current (Irms): 3A; Max DC Current: 3A; Contact Plating: Tin; Mount: Surface Mount; Series: IHLP-1212BZ-11; Inductance: 2.2uH; Current Rating: 3A; Height - Seated (Max): 0.079inch; Radiation Hardening: No; Package Quantity: 3000; Max Operating Temperature: 125°C; Military Standard: Not; Depth: 3.2mm; Rated Current-Max: 3A; Height: 2mm; Lead Free: Lead Free; Termination: SMD/SMT; RoHS Compliant: Yes; Tolerance: 20%; Packaging: Tape and Reel; Case/Package: 1212; Number of Pins: 2; Min Operating Temperature: -55°C; Width: 3mm; Length: 3.6mm
Q15 = CMP-35916-000009-1: as Q9 on sheet MOSFET_JUNCTION; Mount: Surface Mount; Drain to Source Voltage (Vdss): 60V; Packaging: Tape and Reel
R37 R38#2 R40#2 R41#2 R42 R43 R45 R46 = CMP-1012-00623-3: as R23 on sheet PWR_PROT; Number of Pins: 2; Package Reference: 603; Depth: 0.8mm; Mount: SurfaceMount; Package Description: 2-Pin Surface Mount Device, Body 1.6 x 0.85 mm; Datasheet Version: 02/2017; Length: 1.6mm; Lead Free: LeadFree; Height: 0.45mm; Number of Terminations: 2; Max Power Dissipation: 100mW; Min Operating Temperature: -55degC; Datasheet URL: https://industrial.panasonic.com/cdbs/www-data/pdf/RDA0000/AOA0000C304.pdf; Termination: SMD/SMT; Case Code (Metric): 1608; Case Code (Imperial): 0603; Tolerance: 1%; Max Operating Temperature: 155degC; RoHSCompliant: true; Voltage Rating (DC): 75V; Radiation Hardening: No; Packaging: TapeandReel; Composition: ThickFilm; Mounting Technology: SurfaceMount; Manufacturer URL: http://www.panasonic.com/; Width: 0.031inch; REACH SVHC: NoSVHC; Contact Plating: Tin; Military Standard: Not; Package Quantity: 1
R39#2 R44 = CMP-2000-00182-1: Manufacturer: Panasonic; Part Number: ERJ-3EKF1003V
U7 = CMP-0323-00146-3: Buck Step Down Regulator with 3 to 17 V Input and 5 V Output, -40 to 85 degC, 16-Pin QFN (RGT), Green (RoHS & no Sb/Br); Manufacturer: Texas Instruments; Preset Vout(V): 5; Regulated Outputs(#): 1; Synchronous Rectification: TRUE; Duty Cycle(Max)(%): 100; Vin(Min)(V): 3; Vin(Max)(V): 17; Rating: Catalog; SubFamily: Step-Down Regulator; Switch Current Limit(Typ)(A): 4.2; Iq(Typ)(mA): 0.017; ComponentLink1Description: Datasheet; PackageVersion: revH, Oct-2011; ComponentLink2URL: http://www.ti.com/litv/pdf/mpqf119g; Code_JEDEC: MO-220; ComponentLink2Description: Package Specification; Vout(Max)(V): 5; ComponentLink3URL: Samples URL:http://www.ti.com/product/tps62133#samples; PackageReference: RGT0016C; ComponentLink3Description: URL Link1; Mounting Technology: Surface Mount; DatasheetVersion: SLVSAG7; PartNumber: TPS62133RGTR; Iout(Max)(A): 3; Eco-Plan: Green (RoHS & no Sb/Br); PackageDescription: 16-Pin Plastic Quad Flat No-Lead, 3 x 3 mm Body, 0.5 mm Pitch, 1.7 x 1.7 mm Exposed Pad; Topology: Buck; Vout(Min)(V): 5; ComponentLink1URL: http://www.ti.com/general/docs/lit/getliterature.tsp?genericPartNumber=TPS62133&fileType=pdf
U8#2 = CMP-0323-00152-3: Buck Step Down Regulator with 3 to 17 V Input and 3.3 V Output, -40 to 85 degC, 16-Pin QFN (RGT), Green (RoHS & no Sb/Br); Manufacturer: Texas Instruments; Switch Current Limit(Typ)(A): 4.2; Vout(Max)(V): 3.3; Iout(Max)(A): 3; Regulated Outputs(#): 1; Rating: Catalog; Vin(Max)(V): 17; Synchronous Rectification: TRUE; SubFamily: Step-Down Regulator; Duty Cycle(Max)(%): 100; Iq(Typ)(mA): 0.017; DatasheetVersion: SLVSAG7; ComponentLink3Description: URL Link1; PartNumber: TPS62132RGTR; ComponentLink1Description: Datasheet; Vin(Min)(V): 3; PackageDescription: 16-Pin Plastic Quad Flat No-Lead, 3 x 3 mm Body, 0.5 mm Pitch, 1.7 x 1.7 mm Exposed Pad; Mounting Technology: Surface Mount; Preset Vout(V): 3.3; Code_JEDEC: MO-220; ComponentLink1URL: http://www.ti.com/general/docs/lit/getliterature.tsp?genericPartNumber=TPS62132&fileType=pdf; Vout(Min)(V): 3.3; Eco-Plan: Green (RoHS & no Sb/Br); ComponentLink2URL: http://www.ti.com/litv/pdf/mpqf119g; ComponentLink2Description: Package Specification; PackageReference: RGT0016C; PackageVersion: revH, Oct-2011; Topology: Buck; ComponentLink3URL: Samples URL:http://www.ti.com/product/tps62132#samples